# EasyEDA Pro project Hardware.epro, board PCB1
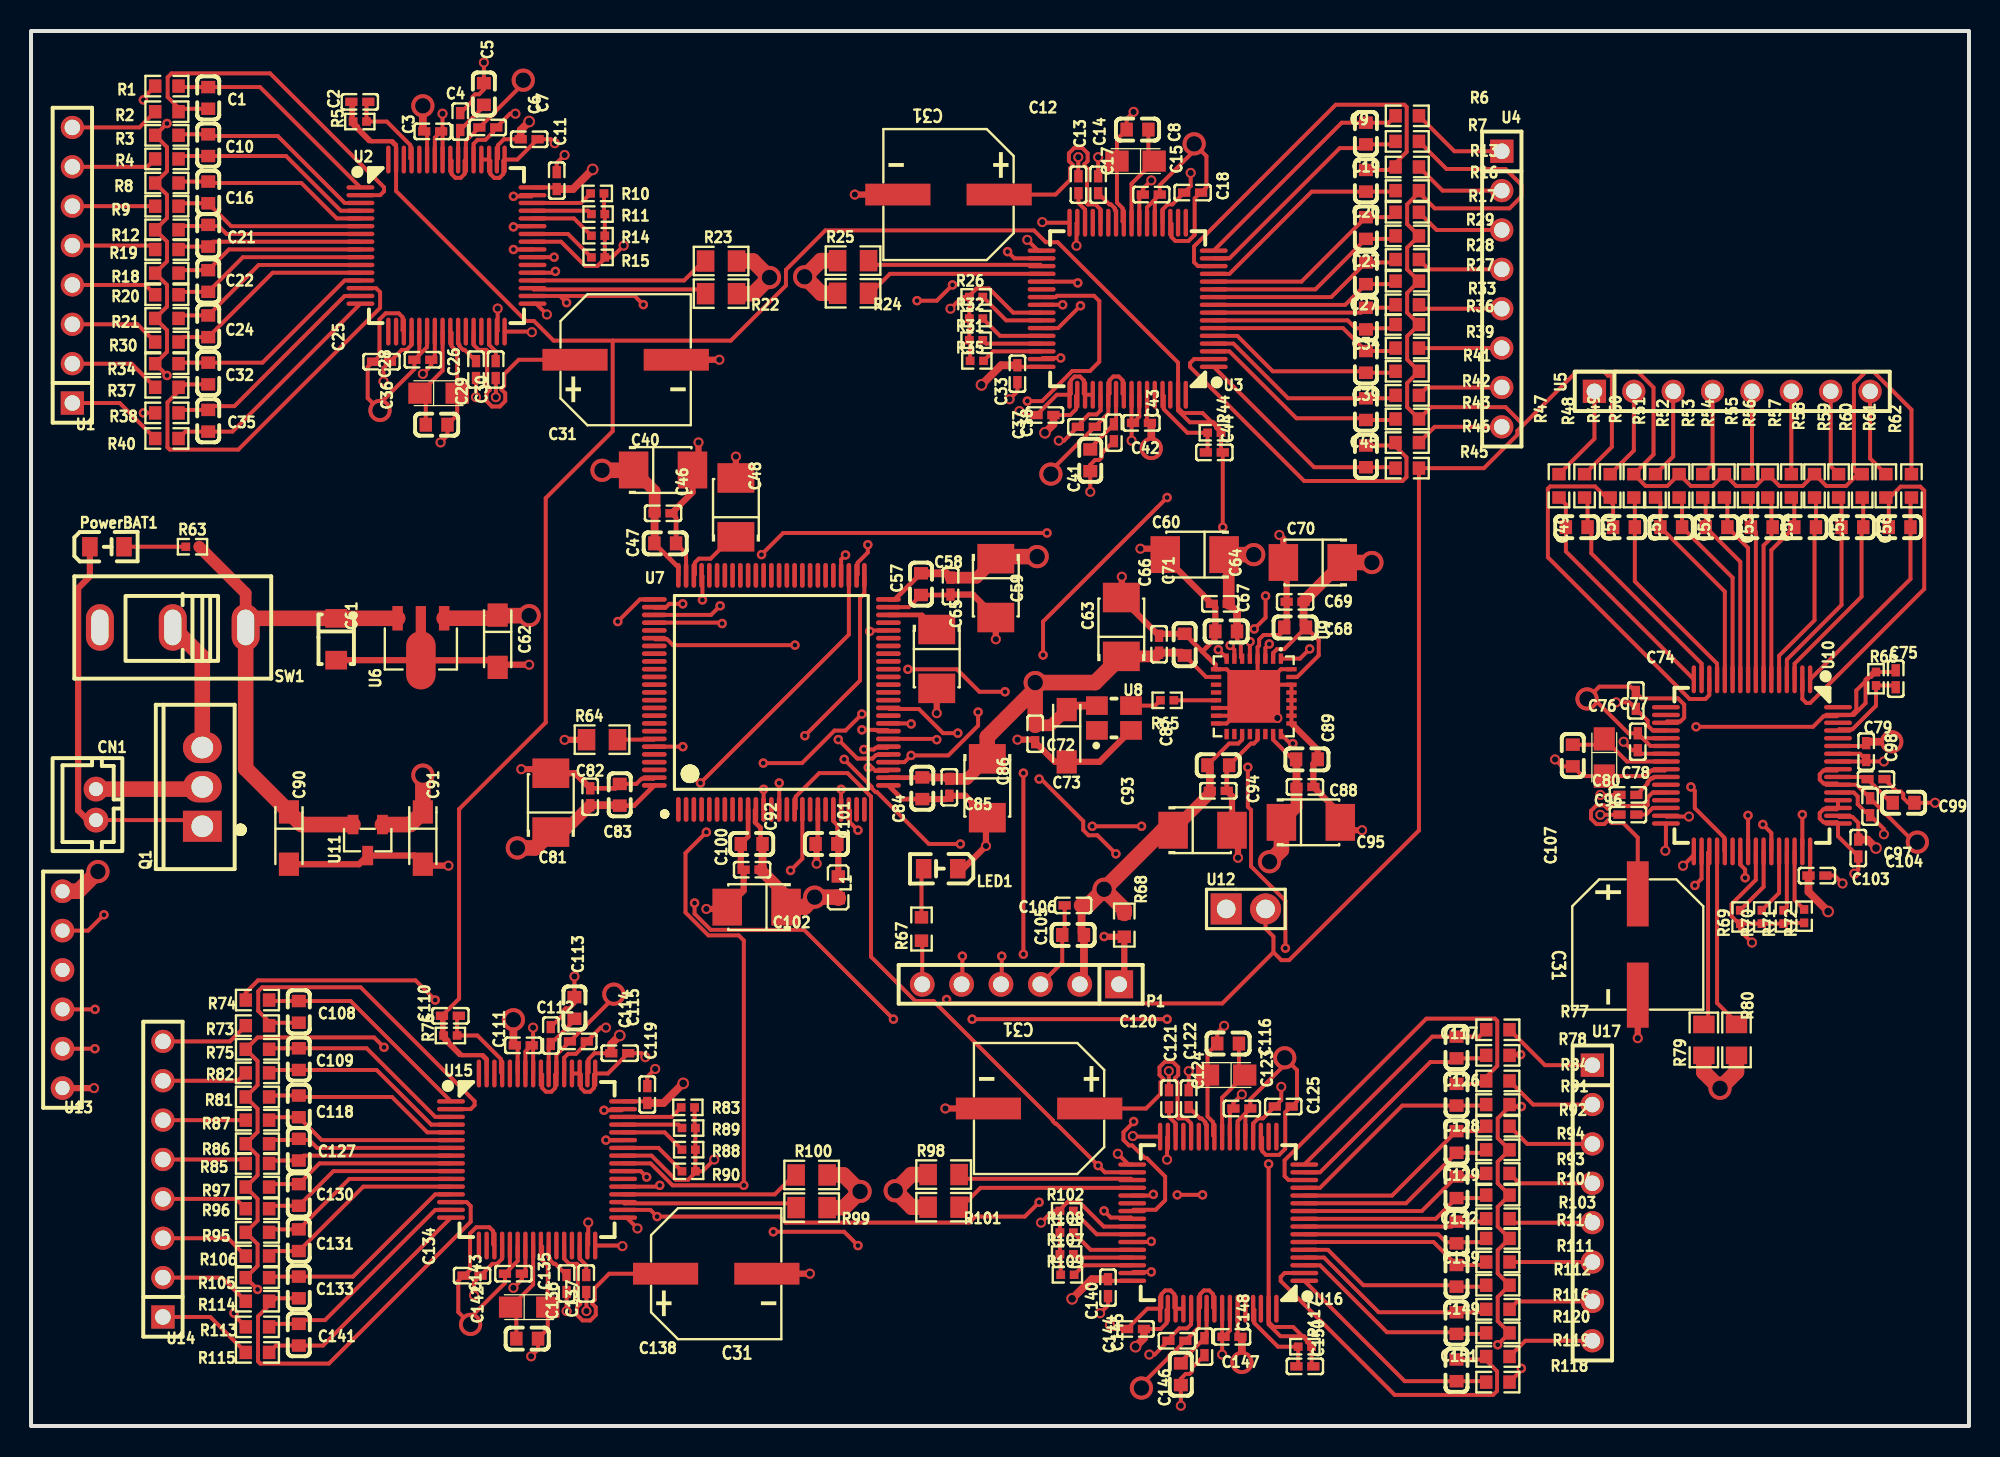
[diagram p1: board, top side]
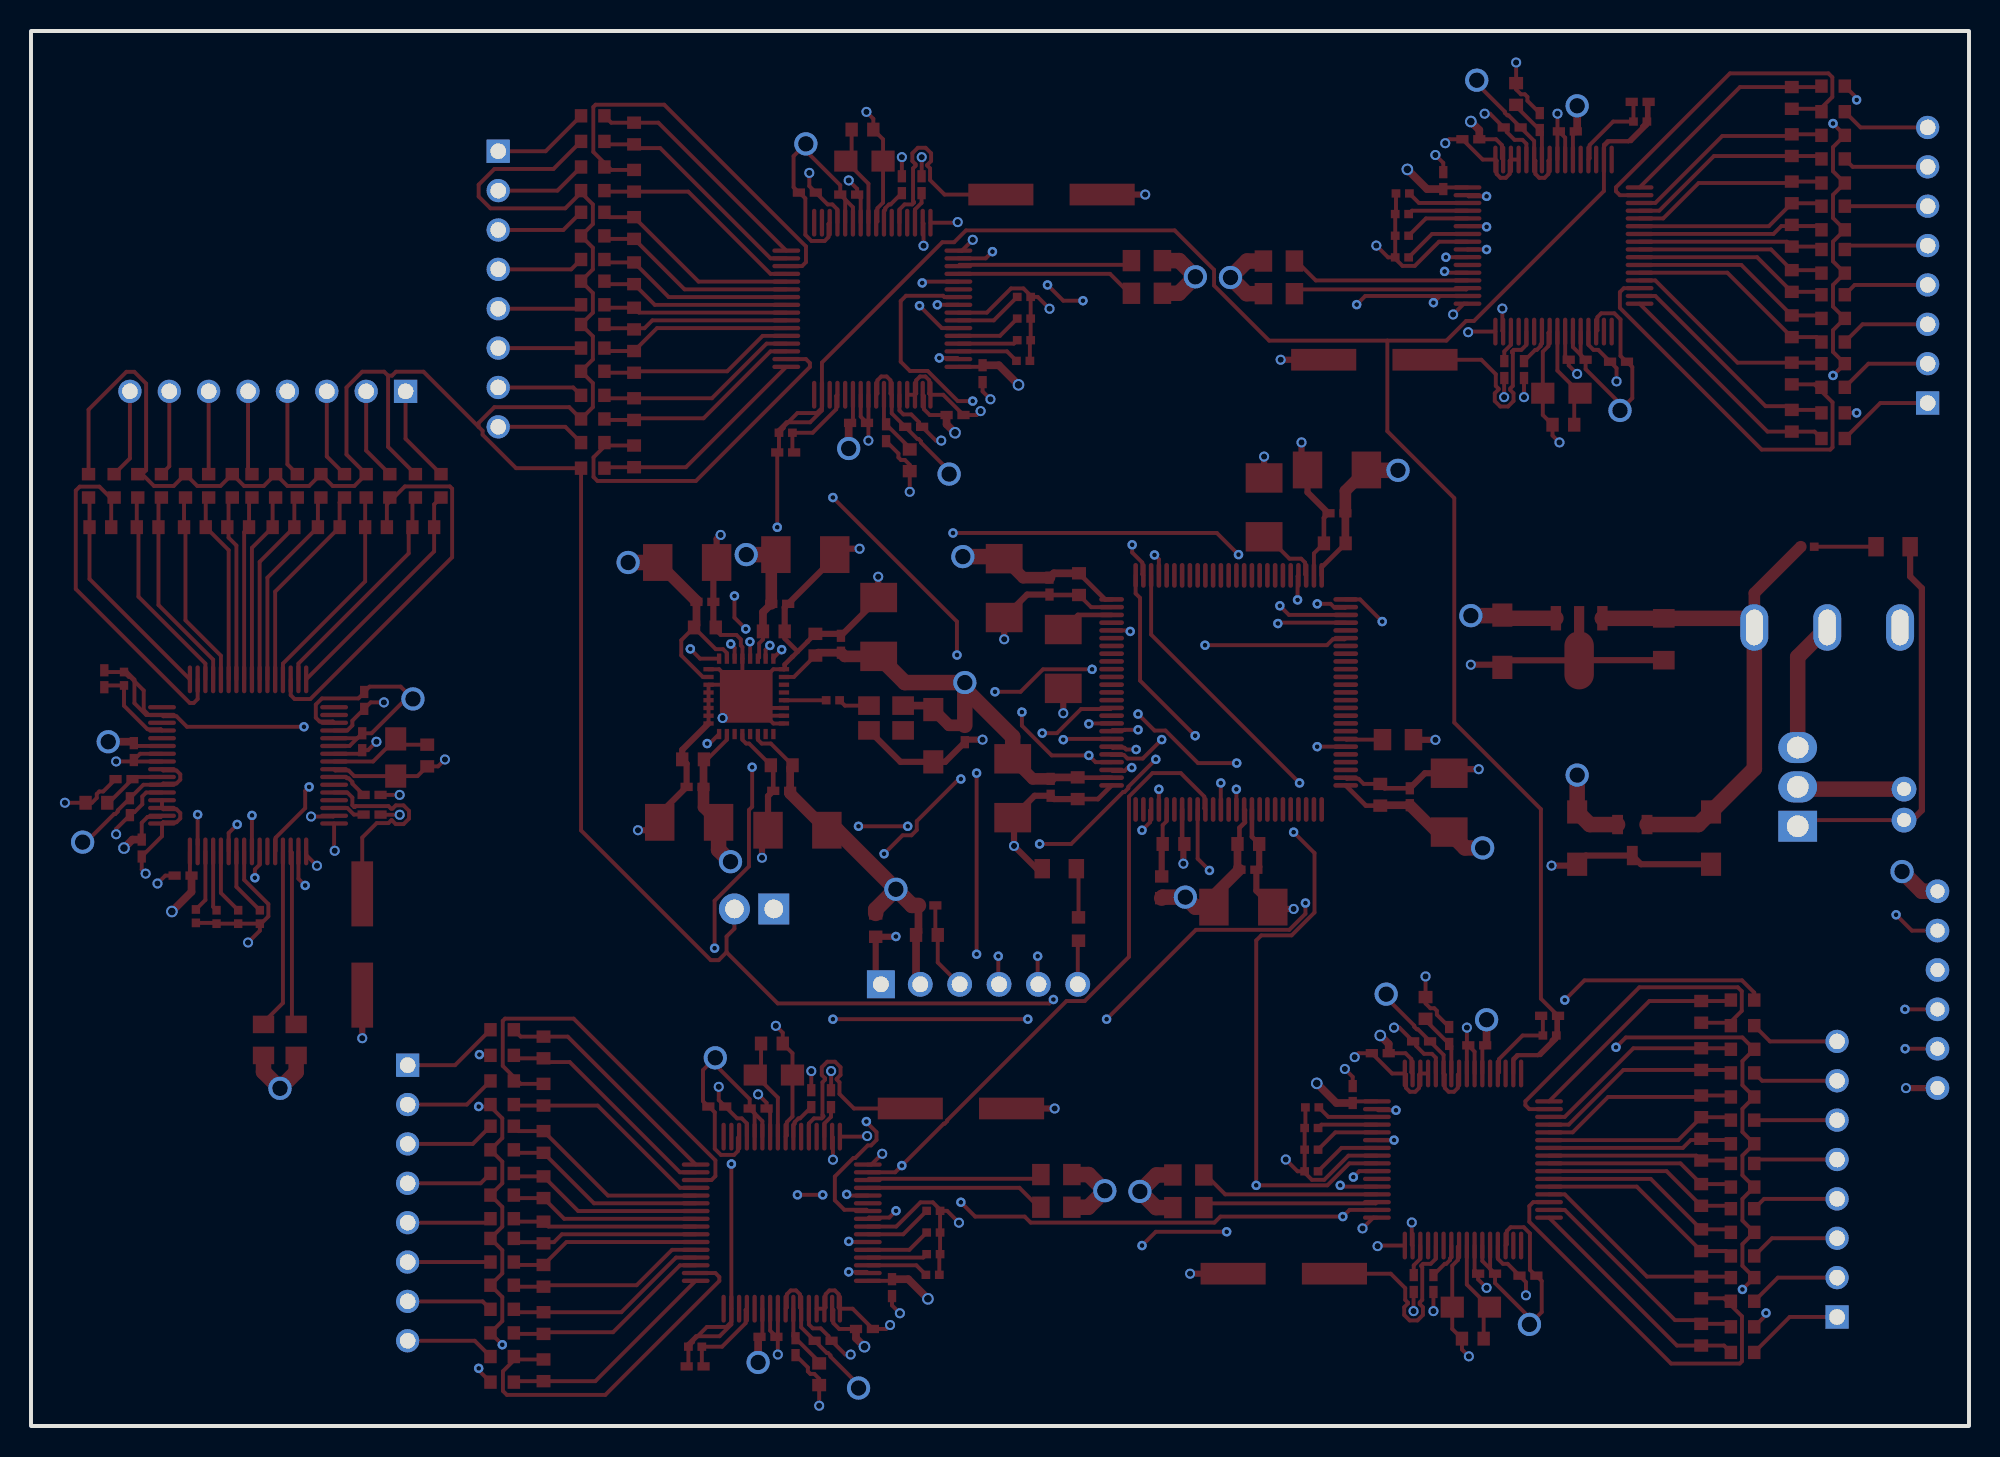
[diagram p2: board, bottom side, seen from below]

Outline 125 x 90 mm; copper layers: Top Layer, DGND, 3.3V, High-Speed Digital Signals, AGND, 5V, Shielding, Analog Signals, Low-Speed Digital Signals, Bottom Layer. Coordinates in mm from the lower left corner of the outline.
Outline path: rectangle 0,90 125,0
Stack: Top Layer 0.035mm / Dielectric1 0.1367mm PP er 4.5 / DGND 0.035mm / Dielectric2 0.1367mm PP er 4.5 / 3.3V 0.035mm / Dielectric3 0.1367mm PP er 4.5 / High-Speed Digital Signals 0.035mm / Dielectric4 0.1367mm PP er 4.5 / AGND 0.035mm / Dielectric5 0.1367mm FR4 er 4.5 / 5V 0.035mm / Dielectric6 0.1367mm PP er 4.5 / Shielding 0.035mm / Dielectric7 0.1367mm PP er 4.5 / Analog Signals 0.035mm / Dielectric8 0.1367mm PP er 4.5 / Low-Speed Digital Signals 0.035mm / Dielectric9 0.1367mm PP er 4.5 / Bottom Layer 0.035mm

## Design rules (mm)
template: Custom Config
spacing copperThickness1oz (default): track to track 0.102, other pairs 0.152 to 0.3
spacing copperThickness2oz: track to track 0.203, other pairs 0.152 to 0.3
spacing copperThicknessInner0.5oz: track to track 0.089, other pairs 0.152 to 0.3
track width copperThickness1oz (default): min 0.102, default 0.254, max 2.54
track width copperThickness2oz: min 0.203, default 0.254, max 2.54
track width copperThickness0.5oz: min 0.089, default 0.254, max 2.54
differential pair differentialPair (default): width min 0.127, default 0.254, max 2.54; gap min 0.152, default 0.152
via viaSize (default): diameter min 0.3, default 0.61, max 10; hole min 0.2, default 0.305, max 6.3

## Placement (name value [footprint] x y rotation side)
C1  1uF  [C0603]  11.43 85.68 90 top
C2  1uF  [C0402]  21.21 85.43 0 top
C3  330nF  [C0402]  25.91 83.52 180 top
C4  100nF  [C0402]  27.69 84.16 90 top
C5  1uF  [C0603]  29.21 85.94 90 top
C6  100nF  [C0402]  29.46 83.78 180 top
C7  1uF  [C0402]  32.13 83.02 180 top
C8  1uF  [C0603]  71.37 83.64 180 top
C9  100nF  [C0603]  86.1 83.39 270 top
C10  1uF  [C0603]  11.43 82.63 90 top
C11  47uF  [C0402]  33.91 80.35 270 top
C12  100nF  [CAP-SMD_BD8.0-L8.3-W8.3-FD]  59.18 79.45 180 top
C13  100nF  [C0402]  67.56 80.08 90 top
C14  1uF  [C0402]  68.83 80.08 90 top
C15  1uF  [CASE-A_3216]  71.24 81.61 180 top
C16  1uF  [C0603]  11.43 79.59 90 top
C17  10uF  [C0402]  72.26 79.45 180 top
C18  100nF  [C0402]  74.93 79.58 180 top
C19  47uF  [C0603]  86.1 80.34 270 top
C20  1uF  [C0603]  86.1 77.29 270 top
C21  100nF  [C0603]  11.43 76.79 90 top
C22  1uF  [C0603]  11.43 73.87 90 top
C23  100uF  [C0603]  86.1 74.37 270 top
C24  1uF  [C0603]  11.43 70.95 90 top
C25  100nF  [C0402]  22.61 68.66 0 top
C26  47uF  [C0402]  25.27 68.79 0 top
C27  1uF  [C0603]  86.1 71.45 270 top
C28  100nF  [CASE-A_3216]  26.29 66.63 0 top
C29  100nF  [C0402]  28.7 68.16 270 top
C30  1uF  [C0402]  29.97 68.16 270 top
C31  47uF  [CAP-SMD_BD8.0-L8.3-W8.3-FD]  38.35 68.79 0 top
C32  100nF  [C0603]  11.43 67.9 90 top
C33  1uF  [C0402]  63.62 67.89 90 top
C34  1uF  [C0603]  86.1 68.65 270 top
C35  100nF  [C0603]  11.43 64.85 90 top
C36  47uF  [C0603]  26.16 64.6 0 top
C37  2.2nF  [C0402]  65.4 65.22 0 top
C38  2.2nF  [C0402]  68.07 64.46 0 top
C39  47uF  [C0603]  86.1 65.61 270 top
C40  1uF  [CAP-SMD_L3.5-W2.8-R-RD]  40.77 61.68 180 top
C41  100nF  [C0603]  68.32 62.3 270 top
C42  2.2nF  [C0402]  69.85 64.08 270 top
C43  2.2nF  [C0402]  71.62 64.72 0 top
C44  100nF  [C0402]  76.32 62.81 180 top
C45  1uF  [C0603]  86.1 62.56 270 top
C46  47uF  [C0402]  40.77 58.89 180 top
C47  47uF  [C0603]  40.91 56.94 0 top
C48  47uF  [CAP-SMD_L3.5-W2.8-R-RD]  45.47 59.27 270 top
C49  1uF  [C0603]  99.7 57.99 0 top
C50  100nF  [C0603]  102.75 57.99 0 top
C51  2.2nF  [C0603]  105.79 57.99 0 top
C52  2.2nF  [C0603]  108.72 57.99 0 top
C53  47uF  [C0603]  111.64 57.99 0 top
C54  1uF  [C0603]  114.43 57.99 0 top
C55  100nF  [C0603]  117.48 57.99 0 top
C56  100nF  [C0603]  120.53 57.99 0 top
C57  1uF  [C0603]  57.4 54.31 270 top
C58  47uF  [C0402]  59.31 54.19 90 top
C59  2.2nF  [CAP-SMD_L3.5-W2.8-R-RD]  62.23 54.06 90 top
C60  2.2nF  [CAP-SMD_L3.5-W2.8-R-RD]  75.06 56.22 0 top
C61  47uF  [CAP-SMD_L3.2-W1.6]  19.69 50.76 270 top
C62  1uF  [CAP-SMD_L3.2-W1.6-RD]  30.1 50.63 270 top
C63  100nF  [CAP-SMD_L3.5-W2.8-R-RD]  70.33 51.55 270 top
C64  1uF  [C0402]  76.71 53.04 0 top
C65  47uF  [CAP-SMD_L3.5-W2.8-R-RD]  58.42 49.49 90 top
C66  1uF  [C0402]  72.76 50.44 90 top
C67  100nF  [C0603]  77.09 51.27 180 top
C68  100nF  [C0603]  81.53 51.52 0 top
C69  1uF  [C0402]  81.53 53.17 180 top
C70  47uF  [CAP-SMD_L3.5-W2.8-R-RD]  82.68 55.71 0 top
C71  100nF  [C0603]  74.41 50.41 270 top
C72  1uF  [C0402]  64.77 44.66 270 top
C73  100nF  [CAP-SMD_L3.2-W1.6-RD]  66.8 44.53 270 top
C74  1uF  [C0402]  103.51 46.81 270 top
C75  1uF  [C0402]  120.27 48.21 270 top
C76  100nF  [C0603]  99.44 43.26 270 top
C77  10uF  [CASE-A_3216]  101.48 43.13 270 top
C78  1uF  [C0402]  103.64 44.15 270 top
C79  1uF  [C0402]  118.37 43.51 90 top
C80  1uF  [C0402]  103 40.72 180 top
C81  47uF  [CAP-SMD_L3.5-W2.8-R-RD]  33.53 40.22 270 top
C82  1uF  [C0402]  36.07 40.6 270 top
C83  100nF  [C0603]  37.97 40.72 90 top
C84  100nF  [C0603]  57.49 41.15 270 top
C85  1uF  [C0402]  59.23 41.21 90 top
C86  47uF  [CAP-SMD_L3.5-W2.8-R-RD]  61.68 41.15 90 top
C87  100nF  [C0603]  76.58 42.63 180 top
C88  1uF  [C0402]  82.17 41.23 180 top
C89  100nF  [C0603]  82.3 43.01 0 top
C90  100nF  [CAP-SMD_L3.2-W1.6-RD]  16.64 37.93 270 top
C91  100nF  [CAP-SMD_L3.2-W1.6-RD]  25.27 37.93 270 top
C92  100nF  [C0603]  46.48 37.55 180 top
C93  47uF  [CAP-SMD_L3.5-W2.8-R-RD]  75.56 38.44 180 top
C94  1uF  [C0402]  76.58 40.98 0 top
C95  47uF  [CAP-SMD_L3.5-W2.8-R-RD]  82.55 38.95 180 top
C96  1uF  [C0402]  103 39.45 180 top
C97  1uF  [C0402]  118.62 39.95 90 top
C98  1uF  [C0402]  119 41.73 0 top
C99  100nF  [C0603]  120.78 40.21 0 top
C100  1uF  [C0402]  46.51 35.89 0 top
C101  100nF  [C0603]  51.31 37.55 0 top
C102  47uF  [CAP-SMD_L3.5-W2.8-R-RD]  46.8 33.48 0 top
C103  1uF  [C0402]  115.19 35.51 180 top
C104  1uF  [C0402]  117.86 37.29 90 top
C105  100nF  [C0603]  67.22 31.68 0 top
C106  1uF  [C0402]  67.22 33.59 180 top
C107  100uF  [CAP-SMD_BD8.0-L8.3-W8.3-FD]  103.64 31.06 270 top
C108  2.2nF  [C0603]  17.27 26.72 90 top
C109  2.2nF  [C0603]  17.27 23.67 90 top
C110  1uF  [C0402]  27.05 26.46 0 top
C111  1uF  [C0402]  31.75 24.56 180 top
C112  1uF  [C0402]  33.53 25.19 90 top
C113  100nF  [C0603]  35.05 26.97 90 top
C114  1uF  [C0402]  35.31 24.81 180 top
C115  1uF  [C0402]  37.97 24.05 180 top
C116  100nF  [C0603]  77.21 24.67 180 top
C117  2.2nF  [C0603]  91.94 24.42 270 top
C118  2.2nF  [C0603]  17.27 20.62 90 top
C119  1uF  [C0402]  39.75 21.38 270 top
C120  100uF  [CAP-SMD_BD8.0-L8.3-W8.3-FD]  65.02 20.48 180 top
C121  1uF  [C0402]  73.4 21.12 90 top
C122  1uF  [C0402]  74.67 21.12 90 top
C123  10uF  [CASE-A_3216]  77.09 22.64 180 top
C124  1uF  [C0402]  78.1 20.48 180 top
C125  1uF  [C0402]  80.77 20.61 180 top
C126  2.2nF  [C0603]  91.94 21.37 270 top
C127  2.2nF  [C0603]  17.27 17.83 90 top
C128  2.2nF  [C0603]  91.94 18.32 270 top
C129  2.2nF  [C0603]  91.94 15.4 270 top
C130  2.2nF  [C0603]  17.27 14.91 90 top
C131  2.2nF  [C0603]  17.27 11.99 90 top
C132  2.2nF  [C0603]  91.94 12.48 270 top
C133  2.2nF  [C0603]  17.27 8.94 90 top
C134  1uF  [C0402]  28.45 9.7 0 top
C135  1uF  [C0402]  31.11 9.83 0 top
C136  1uF  [C0402]  34.54 9.19 270 top
C137  1uF  [C0402]  35.81 9.19 270 top
C138  100uF  [CAP-SMD_BD8.0-L8.3-W8.3-FD]  44.2 9.83 0 top
C139  2.2nF  [C0603]  91.94 9.69 270 top
C140  1uF  [C0402]  69.47 8.93 90 top
C141  2.2nF  [C0603]  17.27 5.89 90 top
C142  100nF  [C0603]  32 5.64 0 top
C143  10uF  [CASE-A_3216]  32.13 7.67 0 top
C144  1uF  [C0402]  71.24 6.26 0 top
C145  1uF  [C0402]  73.91 5.5 0 top
C146  100nF  [C0603]  74.16 3.34 270 top
C147  1uF  [C0402]  75.69 5.12 270 top
C148  1uF  [C0402]  77.47 5.75 0 top
C149  2.2nF  [C0603]  91.94 6.64 270 top
C150  1uF  [C0402]  82.16 3.85 180 top
C151  2.2nF  [C0603]  91.94 3.59 270 top
CN1  B2B-PH-K-S(LF)(SN)  [CONN-TH_B2B-PH-K-S]  4.19 40.09 90 top
L1  BLM18KG601SN1D  [L0603]  52.07 34.75 90 top
LED1  GREEN  [LED0805-RD_GREEN]  58.68 35.95 180 top
P1  HC-05 Input  [HDR-TH_6P-P2.54-V-F]  63.83 28.5 180 top
PowerBAT1  LTST-C170GKT  [LED0805-RD_GREEN]  4.9 56.73 0 top
Q1  FQP47P06  [TO-220F-3_L10.2-W4.9-P2.54-L]  11.05 41.23 90 top
R1  1MΩ  [R0603]  8.76 86.44 0 top
R2  10kΩ  [R0603]  8.76 84.79 0 top
R3  10kΩ  [R0603]  8.76 83.27 0 top
R4  10kΩ  [R0603]  8.76 81.75 0 top
R5  10kΩ  [R0402]  21.21 84.16 180 top
R6  10kΩ  [R0603]  88.77 84.53 180 top
R7  150Ω  [R0603]  88.77 82.88 180 top
R8  10kΩ  [R0603]  8.76 80.19 0 top
R9  10kΩ  [R0603]  8.76 78.7 0 top
R10  10kΩ  [R0402]  36.53 79.52 0 top
R11  33Ω  [R0402]  36.58 78.19 0 top
R12  68Ω  [R0603]  8.76 77.17 0 top
R13  499kΩ  [R0603]  88.77 81.23 180 top
R14  499kΩ  [R0402]  36.58 76.79 0 top
R15  499kΩ  [R0402]  36.58 75.39 0 top
R16  499kΩ  [R0603]  88.77 79.7 180 top
R17  499kΩ  [R0603]  88.77 78.31 180 top
R18  499kΩ  [R0603]  8.76 74.38 0 top
R19  499kΩ  [R0603]  8.76 75.9 0 top
R20  499kΩ  [R0603]  8.76 72.98 0 top
R21  499kΩ  [R0603]  8.76 71.46 0 top
R22  499kΩ  [R0805]  44.51 73.05 180 top
R23  499kΩ  [R0805]  44.51 75.16 180 top
R24  499kΩ  [R0805]  53.02 73.08 0 top
R25  499kΩ  [R0805]  53.02 75.19 0 top
R26  499kΩ  [R0402]  60.96 72.84 180 top
R27  499kΩ  [R0603]  88.77 73.86 180 top
R28  499kΩ  [R0603]  88.77 75.26 180 top
R29  499kΩ  [R0603]  88.77 76.78 180 top
R30  499kΩ  [R0603]  8.76 69.93 0 top
R31  10kΩ  [R0402]  60.96 70.05 180 top
R32  10kΩ  [R0402]  60.96 71.45 180 top
R33  499kΩ  [R0603]  88.77 72.34 180 top
R34  499kΩ  [R0603]  8.76 68.54 0 top
R35  10kΩ  [R0402]  61.01 68.72 180 top
R36  499kΩ  [R0603]  88.77 71.07 180 top
R37  499kΩ  [R0603]  8.76 67.01 0 top
R38  499kΩ  [R0603]  8.76 65.36 0 top
R39  499kΩ  [R0603]  88.77 69.54 180 top
R40  499kΩ  [R0603]  8.76 63.71 0 top
R41  499kΩ  [R0603]  88.77 68.05 180 top
R42  499kΩ  [R0603]  88.77 66.49 180 top
R43  499kΩ  [R0603]  88.77 64.97 180 top
R44  1MΩ  [R0402]  76.32 64.08 0 top
R45  499kΩ  [R0603]  88.77 61.8 180 top
R46  499kΩ  [R0603]  88.77 63.45 180 top
R47  499kΩ  [R0603]  98.56 60.66 270 top
R48  499kΩ  [R0603]  100.21 60.66 270 top
R49  499kΩ  [R0603]  101.86 60.66 270 top
R50  499kΩ  [R0603]  103.38 60.66 270 top
R51  499kΩ  [R0603]  104.78 60.66 270 top
R52  499kΩ  [R0603]  106.3 60.66 270 top
R53  499kΩ  [R0603]  107.83 60.66 270 top
R54  499kΩ  [R0603]  109.22 60.66 270 top
R55  499kΩ  [R0603]  110.75 60.66 270 top
R56  499kΩ  [R0603]  112.02 60.66 270 top
R57  499kΩ  [R0603]  113.54 60.66 270 top
R58  499kΩ  [R0603]  115.04 60.66 270 top
R59  499kΩ  [R0603]  116.59 60.66 270 top
R60  499kΩ  [R0603]  118.11 60.66 270 top
R61  499kΩ  [R0603]  119.64 60.66 270 top
R62  499kΩ  [R0603]  121.29 60.66 270 top
R63  150Ω  [R0402]  10.42 56.73 0 top
R64  10kΩ  [R0805]  36.83 44.28 0 top
R65  33Ω  [R0402]  73.28 46.82 0 top
R66  1MΩ  [R0402]  119 48.21 90 top
R67  68Ω  [R0603]  57.44 32.06 90 top
R68  10kΩ  [R0603]  70.52 32.32 90 top
R69  10kΩ  [R0402]  110.24 32.84 270 top
R70  10kΩ  [R0402]  111.64 32.84 270 top
R71  10kΩ  [R0402]  113.03 32.84 270 top
R72  10kΩ  [R0402]  114.37 32.89 270 top
R73  499kΩ  [R0603]  14.61 25.83 0 top
R74  499kΩ  [R0603]  14.61 27.48 0 top
R75  499kΩ  [R0603]  14.61 24.31 0 top
R76  1MΩ  [R0402]  27.05 25.19 180 top
R77  499kΩ  [R0603]  94.61 25.56 180 top
R78  499kΩ  [R0603]  94.61 23.91 180 top
R79  10kΩ  [R0805]  107.9 24.91 90 top
R80  10kΩ  [R0805]  110 24.91 90 top
R81  499kΩ  [R0603]  14.61 21.23 0 top
R82  499kΩ  [R0603]  14.61 22.78 0 top
R83  10kΩ  [R0402]  42.37 20.56 0 top
R84  499kΩ  [R0603]  94.61 22.26 180 top
R85  499kΩ  [R0603]  14.61 16.94 0 top
R86  499kΩ  [R0603]  14.61 18.21 0 top
R87  499kΩ  [R0603]  14.61 19.73 0 top
R88  10kΩ  [R0402]  42.42 17.83 0 top
R89  10kΩ  [R0402]  42.42 19.22 0 top
R90  10kΩ  [R0402]  42.42 16.43 0 top
R91  499kΩ  [R0603]  94.61 20.74 180 top
R92  499kΩ  [R0603]  94.61 19.34 180 top
R93  499kΩ  [R0603]  94.61 16.29 180 top
R94  499kΩ  [R0603]  94.61 17.82 180 top
R95  499kΩ  [R0603]  14.61 12.49 0 top
R96  499kΩ  [R0603]  14.61 14.02 0 top
R97  499kΩ  [R0603]  14.61 15.41 0 top
R98  10kΩ  [R0805]  58.86 16.22 0 top
R99  10kΩ  [R0805]  50.35 14.09 180 top
R100  10kΩ  [R0805]  50.35 16.2 180 top
R101  10kΩ  [R0805]  58.86 14.12 0 top
R102  10kΩ  [R0402]  66.8 13.88 180 top
R103  499kΩ  [R0603]  94.61 13.37 180 top
R104  499kΩ  [R0603]  94.61 14.9 180 top
R105  499kΩ  [R0603]  14.61 9.57 0 top
R106  499kΩ  [R0603]  14.61 10.97 0 top
R107  10kΩ  [R0402]  66.8 11.09 180 top
R108  10kΩ  [R0402]  66.8 12.48 180 top
R109  10kΩ  [R0402]  66.85 9.75 180 top
R110  499kΩ  [R0603]  94.61 12.1 180 top
R111  499kΩ  [R0603]  94.61 10.58 180 top
R112  499kΩ  [R0603]  94.61 9.08 180 top
R113  499kΩ  [R0603]  14.61 6.4 0 top
R114  499kΩ  [R0603]  14.61 8.05 0 top
R115  499kΩ  [R0603]  14.61 4.75 0 top
R116  499kΩ  [R0603]  94.61 7.53 180 top
R117  1MΩ  [R0402]  82.16 5.12 0 top
R118  499kΩ  [R0603]  94.61 2.83 180 top
R119  499kΩ  [R0603]  94.61 4.48 180 top
R120  499kΩ  [R0603]  94.61 6.01 180 top
SW1  SS-12D10-G050  [SW-TH_SS-12D10-G050]  9.14 51.52 180 top
U1  ADS1299IPAGR  [HDR-TH_8P-P2.54-V-M]  2.67 74.89 90 top
U2  DS1021-1x6SF11-B  [TQFP-64_L10.0-W10.0-P0.50-LS12.0-TL]  26.8 76.16 0 top
U3  MC78L05ACHT1G  [TQFP-64_L10.0-W10.0-P0.50-LS12.0-TL]  70.74 72.08 180 top
U4  HB-PH3-25418PB2GOP  [HDR-TH_8P-P2.54-V-M]  94.87 73.35 270 top
U5  LM3480IM3X-3.3  [HDR-TH_8P-P2.54-V-M]  109.73 66.75 0 top
U6  STM32H750VBT6  [SOT-89-3_L4.5-W2.5-P1.50-LS4.2-BR]  25.15 50.76 90 top
U7  DS1021-1x2SF11-B  [LQFP-100_L14.0-W14.0-P0.50-LS16.0-BL]  47.75 47.33 0 top
U8  2.048MHz  [OSC-SMD_4P-L3.2-W2.5-BL-1]  69.85 45.68 0 top
U9  CDCLVC1310RHBR  [QFN-32_L5.0-W5.0-P0.50-TL-EP3.4]  78.87 47.07 270 top
U10  ADS1299IPAGR  [TQFP-64_L10.0-W10.0-P0.50-LS12.0-TL]  111 42.62 270 top
U11  LM3480IM3X-3.3  [SOT-23-3_L2.9-W1.3-P1.90-LS2.4-BR]  21.72 37.8 90 top
U12  DS1021-1x2SF11-B  [HDR-TH_2P-P2.54-V-M]  78.36 33.36 0 top
U13  DS1021-1x6SF11-B  [CONN-TH_DS1021-1X6SF11-B]  2.03 28.15 270 top
U14  HB-PH3-25418PB2GOP  [HDR-TH_8P-P2.54-V-M]  8.51 15.92 90 top
U15  ADS1299IPAGR  [TQFP-64_L10.0-W10.0-P0.50-LS12.0-TL]  32.64 17.19 0 top
U16  ADS1299IPAGR  [TQFP-64_L10.0-W10.0-P0.50-LS12.0-TL]  76.58 13.12 180 top
U17  HB-PH3-25418PB2GOP  [HDR-TH_8P-P2.54-V-M]  100.71 14.39 270 top

## Footprints (pads in the part's own frame, mm; a bottom-side part is the same pattern mirrored in y, then rotated)
C0402
  rect 0.79x0.54 smd: 1(-0.545,0) 2(0.545,0)
C0603
  rect 0.8x0.9 smd: 1(-0.7,0) 2(0.7,0)
CAP-SMD_BD8.0-L8.3-W8.3-FD
  rect 4.2x1.4 smd: 1(-3.267,0) 2(3.267,0)
CAP-SMD_L3.2-W1.6
  rect 1.2x1.4 smd: 1(-1.35,0) 2(1.35,0)
CAP-SMD_L3.2-W1.6-RD
  rect 1.5x1.296 smd: 1(-1.687,0) 2(1.687,0)
CAP-SMD_L3.5-W2.8-R-RD
  rect 1.9x2.376 smd: 1(1.899,0) 2(-1.899,0)
CASE-A_3216
  rect 1.5x1.359 smd: 1(-1.2,0) 2(1.2,0)
CONN-TH_B2B-PH-K-S
  round 1.6 hole 0.9: 1(1,0) 2(-1,0)
CONN-TH_DS1021-1X6SF11-B
  round 1.524 hole 0.914: 1(-6.35,0) 2(-3.81,0) 3(-1.27,0) 4(1.27,0) 5(3.81,0) 6(6.35,0)
HDR-TH_2P-P2.54-V-M
  rect 2x2 hole 1.2: 1(-1.27,0)
  round 2 hole 1.2: 2(1.27,0)
HDR-TH_6P-P2.54-V-F
  rect 1.8x1.8 hole 1.02: 1(-6.35,0)
  round 1.6 hole 1.02: 2(-3.81,0) 3(-1.27,0) 4(1.27,0) 5(3.81,0) 6(6.35,0)
HDR-TH_8P-P2.54-V-M
  rect 1.5x1.5 hole 1: 1(-8.89,0)
  round 1.5 hole 1: 2(-6.35,0) 3(-3.81,0) 4(-1.27,0) 5(1.27,0) 6(3.81,0) 7(6.35,0) 8(8.89,0)
L0603
  rect 0.8x0.864 smd: 1(-0.7,0) 2(0.7,0)
LED0805-RD_GREEN
  rect 1x1.25 smd: 1(-1.1,0) 2(1.1,0)
LQFP-100_L14.0-W14.0-P0.50-LS16.0-BL
  oval 0.3x1.6 smd: 1(-6,-7.55) 2(-5.5,-7.55) 3(-5,-7.55) 4(-4.5,-7.55) 5(-4,-7.55) 6(-3.5,-7.55) 7(-3,-7.55) 8(-2.5,-7.55) 9(-2,-7.55) 10(-1.5,-7.55) 11(-1,-7.55) 12(-0.5,-7.55) 13(0,-7.55) 14(0.5,-7.55) 15(1,-7.55) 16(1.5,-7.55) 17(2,-7.55) 18(2.5,-7.55) 19(3,-7.55) 20(3.5,-7.55) 21(4,-7.55) 22(4.5,-7.55) 23(5,-7.55) 24(5.5,-7.55) 25(6,-7.55) 51(6,7.55) 52(5.5,7.55) 53(5,7.55) 54(4.5,7.55) 55(4,7.55) 56(3.5,7.55) 57(3,7.55) 58(2.5,7.55) 59(2,7.55) 60(1.5,7.55) 61(1,7.55) 62(0.5,7.55) 63(0,7.55) 64(-0.5,7.55) 65(-1,7.55) 66(-1.5,7.55) 67(-2,7.55) 68(-2.5,7.55) 69(-3,7.55) 70(-3.5,7.55) 71(-4,7.55) 72(-4.5,7.55) 73(-5,7.55) 74(-5.5,7.55) 75(-6,7.55)
  oval 1.6x0.3 smd: 26(7.55,-6) 27(7.55,-5.5) 28(7.55,-5) 29(7.55,-4.5) 30(7.55,-4) 31(7.55,-3.5) 32(7.55,-3) 33(7.55,-2.5) 34(7.55,-2) 35(7.55,-1.5) 36(7.55,-1) 37(7.55,-0.5) 38(7.55,0) 39(7.55,0.5) 40(7.55,1) 41(7.55,1.5) 42(7.55,2) 43(7.55,2.5) 44(7.55,3) 45(7.55,3.5) 46(7.55,4) 47(7.55,4.5) 48(7.55,5) 49(7.55,5.5) 50(7.55,6) 76(-7.55,6) 77(-7.55,5.5) 78(-7.55,5) 79(-7.55,4.5) 80(-7.55,4) 81(-7.55,3.5) 82(-7.55,3) 83(-7.55,2.5) 84(-7.55,2) 85(-7.55,1.5) 86(-7.55,1) 87(-7.55,0.5) 88(-7.55,0) 89(-7.55,-0.5) 90(-7.55,-1) 91(-7.55,-1.5) 92(-7.55,-2) 93(-7.55,-2.5) 94(-7.55,-3) 95(-7.55,-3.5) 96(-7.55,-4) 97(-7.55,-4.5) 98(-7.55,-5) 99(-7.55,-5.5) 100(-7.55,-6)
OSC-SMD_4P-L3.2-W2.5-BL-1
  rect 1.4x1.2 smd: 1(-1.1,-0.8) 2(1.1,-0.8) 3(1.1,0.8) 4(-1.1,0.8)
QFN-32_L5.0-W5.0-P0.50-TL-EP3.4
  rect 0.665x0.28 smd: 1(-2.433,1.75) 2(-2.433,1.25) 3(-2.433,0.75) 4(-2.433,0.25) 5(-2.433,-0.25) 6(-2.433,-0.75) 7(-2.433,-1.25) 8(-2.433,-1.75) 17(2.433,-1.75) 18(2.433,-1.25) 19(2.433,-0.75) 20(2.433,-0.25) 21(2.433,0.25) 22(2.433,0.75) 23(2.433,1.25) 24(2.433,1.75)
  rect 0.28x0.665 smd: 9(-1.75,-2.433) 10(-1.25,-2.433) 11(-0.75,-2.433) 12(-0.25,-2.433) 13(0.25,-2.433) 14(0.75,-2.433) 15(1.25,-2.433) 16(1.75,-2.433) 25(1.75,2.433) 26(1.25,2.433) 27(0.75,2.433) 28(0.25,2.433) 29(-0.25,2.433) 30(-0.75,2.433) 31(-1.25,2.433) 32(-1.75,2.433)
  rect 3.4x3.4 smd: 33(0,0)
R0402
  rect 0.566x0.54 smd: 1(-0.433,0) 2(0.433,0)
R0603
  rect 0.806x0.864 smd: 1(-0.753,0) 2(0.753,0)
R0805
  rect 1.133x1.377 smd: 1(-1,0) 2(1,0)
SOT-23-3_L2.9-W1.3-P1.90-LS2.4-BR
  rect 1.25x0.7 smd: 1(1,-0.95) 2(1,0.95) 3(-1,0)
SOT-89-3_L4.5-W2.5-P1.50-LS4.2-BR
  rect 1.575x0.672 smd: 1(1.356,-1.5) 3(1.356,1.5)
  custom 5.377x1.9 smd: 2(-1.356,0)
SW-TH_SS-12D10-G050
  oval 1.8x3 hole 1.1x2.3: 1(-4.7,0) 2(0,0) 3(4.7,0)
TO-220F-3_L10.2-W4.9-P2.54-L
  rect 2x2.5 hole 1.4: 1(-2.54,0)
  oval 2x2.5 hole 1.4: 2(0,0) 3(2.54,0)
TQFP-64_L10.0-W10.0-P0.50-LS12.0-TL
  oval 1.8x0.28 smd: 1(-5.55,3.75) 2(-5.55,3.25) 3(-5.55,2.75) 4(-5.55,2.25) 5(-5.55,1.75) 6(-5.55,1.25) 7(-5.55,0.75) 8(-5.55,0.25) 9(-5.55,-0.25) 10(-5.55,-0.75) 11(-5.55,-1.25) 12(-5.55,-1.75) 13(-5.55,-2.25) 14(-5.55,-2.75) 15(-5.55,-3.25) 16(-5.55,-3.75) 33(5.55,-3.75) 34(5.55,-3.25) 35(5.55,-2.75) 36(5.55,-2.25) 37(5.55,-1.75) 38(5.55,-1.25) 39(5.55,-0.75) 40(5.55,-0.25) 41(5.55,0.25) 42(5.55,0.75) 43(5.55,1.25) 44(5.55,1.75) 45(5.55,2.25) 46(5.55,2.75) 47(5.55,3.25) 48(5.55,3.75)
  oval 0.28x1.8 smd: 17(-3.75,-5.55) 18(-3.25,-5.55) 19(-2.75,-5.55) 20(-2.25,-5.55) 21(-1.75,-5.55) 22(-1.25,-5.55) 23(-0.75,-5.55) 24(-0.25,-5.55) 25(0.25,-5.55) 26(0.75,-5.55) 27(1.25,-5.55) 28(1.75,-5.55) 29(2.25,-5.55) 30(2.75,-5.55) 31(3.25,-5.55) 32(3.75,-5.55) 49(3.75,5.55) 50(3.25,5.55) 51(2.75,5.55) 52(2.25,5.55) 53(1.75,5.55) 54(1.25,5.55) 55(0.75,5.55) 56(0.25,5.55) 57(-0.25,5.55) 58(-0.75,5.55) 59(-1.25,5.55) 60(-1.75,5.55) 61(-2.25,5.55) 62(-2.75,5.55) 63(-3.25,5.55) 64(-3.75,5.55)

## Nets
+3.3V: C7.2 C11.2 C33.2 C37.2 C40.1 C46.2 C47.1 C57.1 C58.2 C59.1 C60.1 C63.1 C64.2 C66.1 C67.1 C68.2 C69.1 C70.1 C71.2 C72.1 C73.1 C81.1 C82.2 C83.1 C84.1 C85.2 C86.1 C87.2 C88.2 C89.1 C91.1 C92.1 C93.1 C94.1 C95.1 C100.2 C102.1 C103.2 C104.2 C105.2 C106.1 C115.2 C119.2 C140.2 C144.2 L1.1 P1.2 R22.1 R23.1 R24.1 R25.1 R68.2 R79.1 R80.1 R98.1 R99.1 R100.1 R101.1 U2.48 U2.50 U3.48 U3.50 U7.11 U7.27 U7.50 U7.75 U7.100 U8.4 U9.2 U9.6 U9.10 U9.19 U9.23 U9.31 U10.48 U10.50 U11.1 U13.1 U15.48 U15.50 U16.48 U16.50
+5V: C3.2 C6.2 C17.1 C18.1 C25.1 C26.1 C38.2 C43.2 C62.1 C74.1 C78.1 C79.2 C97.2 C111.2 C114.2 C124.1 C125.1 C134.1 C135.1 C145.2 C148.2 U2.19 U2.21 U2.22 U2.54 U2.56 U2.59 U3.19 U3.21 U3.22 U3.54 U3.56 U3.59 U6.1 U10.19 U10.21 U10.22 U10.54 U10.56 U10.59 U15.19 U15.21 U15.22 U15.54 U15.56 U15.59 U16.19 U16.21 U16.22 U16.54 U16.56 U16.59
AGND: C3.1 C4.2 C5.2 C6.1 C8.2 C12.2 C13.2 C14.2 C15.2 C17.2 C18.2 C25.2 C26.2 C28.2 C29.2 C30.2 C31.2 C36.2 C38.1 C41.2 C42.2 C43.1 C61.2 C62.2 C74.2 C76.2 C77.2 C78.2 C79.1 C80.2 C96.2 C97.1 C98.2 C99.2 C107.2 C111.1 C112.2 C113.2 C114.1 C116.2 C120.2 C121.2 C122.2 C123.2 C124.2 C125.2 C134.2 C135.2 C136.2 C137.2 C138.2 C142.2 C143.2 C145.1 C146.2 C147.2 C148.1 U2.20 U2.23 U2.25 U2.32 U2.53 U2.57 U2.58 U3.20 U3.23 U3.25 U3.32 U3.53 U3.57 U3.58 U6.2 U10.20 U10.23 U10.25 U10.32 U10.53 U10.57 U10.58 U15.20 U15.23 U15.25 U15.32 U15.53 U15.57 U15.58 U16.20 U16.23 U16.25 U16.32 U16.53 U16.57 U16.58
DGND: C7.1 C11.1 C33.1 C37.1 C40.2 C46.1 C47.2 C48.2 C57.2 C58.1 C59.2 C60.2 C63.2 C64.1 C65.2 C66.2 C67.2 C68.1 C69.2 C70.2 C71.1 C72.2 C73.2 C81.2 C82.1 C83.2 C84.2 C85.1 C86.2 C87.1 C88.1 C89.2 C90.2 C91.2 C92.2 C93.2 C94.2 C95.2 C100.1 C101.1 C102.2 C103.1 C104.1 C105.1 C106.2 C115.1 C119.1 C140.1 C144.1 LED1.1 P1.3 R10.2 R11.2 R14.2 R15.2 R26.2 R31.2 R32.2 R35.2 R64.1 R69.2 R70.2 R71.2 R72.2 R83.2 R88.2 R89.2 R90.2 R102.2 R107.2 R108.2 R109.2 U2.31 U2.33 U2.41 U2.49 U2.51 U2.52 U3.31 U3.33 U3.41 U3.49 U3.51 U3.52 U7.10 U7.19 U7.26 U7.49 U7.74 U7.99 U8.2 U9.4 U9.9 U9.14 U9.15 U9.16 U9.21 U9.25 U9.26 U9.27 U9.28 U9.29 U9.30 U9.32 U9.33 U10.31 U10.33 U10.41 U10.49 U10.51 U10.52 U11.3 U13.3 U13.6 U15.31 U15.33 U15.41 U15.49 U15.51 U15.52 U16.31 U16.33 U16.41 U16.49 U16.51 U16.52
GND: CN1.2 PowerBAT1.1 Q1.1
BAT: C61.1 C90.1 R63.2 SW1.1 U6.3 U11.2
BIAS: C2.1 C44.1 C75.1 C110.1 C150.1 R5.2 R44.2 R66.2 R76.2 R117.2 U2.63 U3.63 U10.63 U12.1 U15.63 U16.63
CLK1: U2.37 U9.1
CLK2: U3.37 U9.3
CLK3: U9.5 U15.37
CLK4: U9.7 U16.37
CLK5: U9.8 U10.37
CLK6: U9.17
CLK7: U9.18
CLK8: U9.20
CLK9: U9.22
CLK10: U7.12 U9.24
CS1: U2.39 U7.28
CS2: U3.39 U7.32
CS3: U7.51 U15.39
CS4: U7.52 U16.39
CS5: U7.77 U10.39
CS6: U7.80
CS7: U7.3
CS8: U7.2
CS9: U7.85
CS10: U7.84
DRDY1: U2.47 U7.33
DRDY2: U3.47 U7.34
DRDY3: U7.53 U15.47
DRDY4: U7.54 U16.47
DRDY5: U7.81 U10.47
DRDY6: U7.82
DRDY7: U7.97
DRDY8: U7.96
DRDY9: U7.87
DRDY10: U7.86
E1: R6.1 R40.1 R47.1 R77.1 R115.1 U1.1 U4.1 U5.1 U14.1 U17.1
E2: R13.1 R37.1 R49.1 R84.1 R114.1 U1.2 U4.2 U5.2 U14.2 U17.2
E3: R17.1 R30.1 R51.1 R92.1 R106.1 U1.3 U4.3 U5.3 U14.3 U17.3
E4: R20.1 R28.1 R53.1 R93.1 R96.1 U1.4 U4.4 U5.4 U14.4 U17.4
E5: R19.1 R33.1 R55.1 R85.1 R103.1 U1.5 U4.5 U5.5 U14.5 U17.5
E6: R9.1 R39.1 R57.1 R87.1 R111.1 U1.6 U4.6 U5.6 U14.6 U17.6
E7: R4.1 R42.1 R59.1 R82.1 R116.1 U1.7 U4.7 U5.7 U14.7 U17.7
E8: R2.1 R46.1 R61.1 R73.1 R119.1 U1.8 U4.8 U5.8 U14.8 U17.8
IN1N: C9.2 C35.2 C49.2 C117.2 C141.2 R7.2 R38.2 R48.2 R78.2 R113.2 U2.15 U3.15 U10.15 U15.15 U16.15
IN1P: C9.1 C35.1 C49.1 C117.1 C141.1 R6.2 R40.2 R47.2 R77.2 R115.2 U2.16 U3.16 U10.16 U15.16 U16.16
IN2N: C19.2 C32.2 C50.2 C126.2 C133.2 R16.2 R34.2 R50.2 R91.2 R105.2 U2.13 U3.13 U10.13 U15.13 U16.13
IN2P: C19.1 C32.1 C50.1 C126.1 C133.1 R13.2 R37.2 R49.2 R84.2 R114.2 U2.14 U3.14 U10.14 U15.14 U16.14
IN3N: C20.2 C24.2 C51.2 C128.2 C131.2 R21.2 R29.2 R52.2 R94.2 R95.2 U2.11 U3.11 U10.11 U15.11 U16.11
IN3P: C20.1 C24.1 C51.1 C128.1 C131.1 R17.2 R30.2 R51.2 R92.2 R106.2 U2.12 U3.12 U10.12 U15.12 U16.12
IN4N: C22.2 C23.2 C52.2 C129.2 C130.2 R18.2 R27.2 R54.2 R97.2 R104.2 U2.9 U3.9 U10.9 U15.9 U16.9
IN4P: C22.1 C23.1 C52.1 C129.1 C130.1 R20.2 R28.2 R53.2 R93.2 R96.2 U2.10 U3.10 U10.10 U15.10 U16.10
IN5N: C21.2 C27.2 C53.2 C127.2 C132.2 R12.2 R36.2 R56.2 R86.2 R110.2 U2.7 U3.7 U10.7 U15.7 U16.7
IN5P: C21.1 C27.1 C53.1 C127.1 C132.1 R19.2 R33.2 R55.2 R85.2 R103.2 U2.8 U3.8 U10.8 U15.8 U16.8
IN6N: C16.2 C34.2 C54.2 C118.2 C139.2 R8.2 R41.2 R58.2 R81.2 R112.2 U2.5 U3.5 U10.5 U15.5 U16.5
IN6P: C16.1 C34.1 C54.1 C118.1 C139.1 R9.2 R39.2 R57.2 R87.2 R111.2 U2.6 U3.6 U10.6 U15.6 U16.6
IN7N: C10.2 C39.2 C55.2 C109.2 C149.2 R3.2 R43.2 R60.2 R75.2 R120.2 U2.3 U3.3 U10.3 U15.3 U16.3
IN7P: C10.1 C39.1 C55.1 C109.1 C149.1 R4.2 R42.2 R59.2 R82.2 R116.2 U2.4 U3.4 U10.4 U15.4 U16.4
IN8N: C1.2 C45.2 C56.2 C108.2 C151.2 R1.2 R45.2 R62.2 R74.2 R118.2 U2.1 U3.1 U10.1 U15.1 U16.1
IN8P: C1.1 C45.1 C56.1 C108.1 C151.1 R2.2 R46.2 R61.2 R73.2 R119.2 U2.2 U3.2 U10.2 U15.2 U16.2
MISO1: U2.43 U3.43 U7.30
MISO2: U7.17 U15.43 U16.43
MISO3: U7.79 U10.43
MISO4: U7.4
MISO5: U7.90
MOSI1: U2.34 U3.34 U7.31
MOSI2: U7.16 U15.34 U16.34
MOSI3: U7.36 U10.34
MOSI4: U7.5
MOSI5: U7.91
OSC: R65.2 U9.13
PA13: U7.72 U13.2
PA14: U7.76 U13.4
PB8: P1.1 R68.1 U7.95
REF: R1.1 R3.1 R7.1 R8.1 R12.1 R16.1 R18.1 R21.1 R27.1 R29.1 R34.1 R36.1 R38.1 R41.1 R43.1 R45.1 R48.1 R50.1 R52.1 R54.1 R56.1 R58.1 R60.1 R62.1 R74.1 R75.1 R78.1 R81.1 R86.1 R91.1 R94.1 R95.1 R97.1 R104.1 R105.1 R110.1 R112.1 R113.1 R118.1 R120.1 U12.2
RESET: U7.14 U13.5
RX: P1.5 U7.23
SCLK1: U2.40 U3.40 U7.29
SCLK2: U7.46 U15.40 U16.40
SCLK3: U7.78 U10.40
SCLK4: U7.1
SCLK5: U7.89
START: U2.38 U3.38 U7.35 U10.38 U15.38 U16.38
TX: P1.4 U7.22
$1N4527: C48.1 U7.73
$1N4585: R64.2 U7.94
$1N4638: C65.1 U7.48
$1N4732: PowerBAT1.2 R63.1
$1N4759: R23.2 R24.2 R80.2 R100.2 R101.2 U2.36 U3.36 U10.36 U15.36 U16.36
$1N4761: R22.2 R25.2 R79.2 R98.2 R99.2 U2.35 U3.35 U10.35 U15.35 U16.35
$1N7784: C101.2 L1.2 U7.21
$1N9609: R65.1 U8.3
$1N10274: LED1.2 R67.2
$1N10295: P1.6 R67.1
$1N10676: Q1.3 SW1.2
$1N10712: CN1.1 Q1.2
$1N11001: R14.1 R32.1 R70.1 R88.1 R108.1 U2.44 U3.44 U10.44 U15.44 U16.44
$1N11004: R10.1 R35.1 R72.1 R83.1 R109.1 U2.46 U3.46 U10.46 U15.46 U16.46
$1N11007: R11.1 R31.1 R71.1 R89.1 R107.1 U2.45 U3.45 U10.45 U15.45 U16.45
$1N11015: R15.1 R26.1 R69.1 R90.1 R102.1 U2.42 U3.42 U10.42 U15.42 U16.42
$1N12604: C14.1 C29.1 C80.1 C122.1 C136.1 U2.26 U3.26 U10.26 U15.26 U16.26
$1N12673: C13.1 C30.1 C96.1 C121.1 C137.1 U2.30 U3.30 U10.30 U15.30 U16.30
$1N12768: C12.1 C31.1 C107.1 C120.1 C138.1 U2.28 U3.28 U10.28 U15.28 U16.28
$1N13215: C8.1 C15.1 C28.1 C36.1 C76.1 C77.1 C116.1 C123.1 C142.1 C143.1 U2.24 U3.24 U10.24 U15.24 U16.24
$1N13777: C4.1 C5.1 C41.1 C42.1 C98.1 C99.1 C112.1 C113.1 C146.1 C147.1 U2.55 U3.55 U10.55 U15.55 U16.55
$1N14600: C2.2 C44.2 C75.2 C110.2 C150.2 R5.1 R44.1 R66.1 R76.1 R117.1 U2.61 U3.61 U10.61 U15.61 U16.61

Pads without a net: SW1 3; U2 17 18 27 29 60 62 64; U3 17 18 27 29 60 62 64; U7 6 7 8 9 13 15 18 20 24 25 37 38 39 40 41 42 43 44 45 47 55 56 57 58 59 60 61 62 63 64 65 66 67 68 69 70 71 83 88 92 93 98; U8 1; U9 11 12; U10 17 18 27 29 60 62 64; U15 17 18 27 29 60 62 64; U16 17 18 27 29 60 62 64

## Via types
v1: diameter 0.75, hole 0.5, Top Layer to Bottom Layer, 10 vias
v2: diameter 1.5, hole 1, Top Layer to Bottom Layer, 32 vias
v3: diameter 0.61, hole 0.305, Top Layer to Bottom Layer, 117 vias
v4: diameter 0.65, hole 0.4, Top Layer to Bottom Layer, 94 vias

## Routing (per net, layer and track width the routed paths; a pad name or vN(x,y) marks a point on that pad's centre or on a via; arc(x,y) is an arc through that point)
+3.3V: length 208.4
  Top Layer w0.254: U10.48 114.75,35.61 C103.2 ; C144.2 72.87,6.26 73.25,6.63 73.25,7.49 U16.50 ; C37.2 67.03,65.22 67.4,65.6 67.4,66.45 U3.50 ; U16.48 69.57,9.37 C140.2 ; U9.31 81.67,48.32 83.06,49.72 83.06,50.69 C68.2 80.83,50.12 80.36,50.12 80.12,49.87 U9.2 ; U9.6 78.04,49.59 78.04,50.49 77.79,50.74 C67.1 ; 35.89,22.74 35.97,22.82 35.97,23.68 36.34,24.05 C115.2 ; C89.1 81.38,43.01 80.12,44.28 U9.23 ; C7.2 30.5,83.02 30.13,82.64 30.13,81.79 U2.50 ; U3.48 63.73,68.33 C33.2 ; C87.2 77.28,44.03 77.87,44.03 78.12,44.27 U9.19 ; U2.48 33.81,79.91 C11.2 ; C104.2 117.86,38.92 117.49,39.29 116.63,39.29 U10.50 ; U9.10 75.79,48.32 C71.2 ; 39.75,20.84 39.65,20.94 U15.48
  Top Layer w0.3: C92.1 47.06,37.68 47.06,38.59 46.7,38.94 46.7,39.73 U7.11 ; C83.1 38.9,40.02 U7.100 ; U7.27 57.47,41.83 C84.1 ; U7.75 41.75,55.4 C47.1 ; C57.1 55.72,53.33 U7.50
  Top Layer w0.5: C87.2 76.04,42.47 C94.1 ; C71.2 74.23,49.89 C66.1 ; C37.2 65.95,64.63 v1(65.4,64.08) ; C73.1 67.06,46.48 U8.4 ; C7.2 31.59,83.61 v1(32.13,84.16) ; C144.2 71.79,5.66 v1(71.24,5.12) ; C88.2 81.62,42.98 C89.1 ; C68.2 82.08,51.67 82.08,53.17 ; C57.1 59.03,55.01 C58.2 ; v1(36.22,81.07) 34.96,79.8 C11.2 ; 39.75,20.84 40.8,20.84 v1(42.07,22.11) ; C104.2 118.46,37.83 v1(119,37.29) ; C85.2 59.14,41.85 C84.1 ; v1(37.97,25.19) 37.43,24.65 C115.2 ; C83.1 37.94,40.05 C82.2 ; 47.06,35.89 47.18,36.02 C92.1 ; C106.1 67.76,31.84 C105.2 67.91,28.77 P1.2 ; v1(67.15,8.21) 68.42,9.47 C140.2 ; C46.2 40.22,56.96 C47.1 ; C103.2 114.65,34.46 v1(115.91,33.19) ; C64.2 77.79,52.51 C67.1 ; C33.2 62.57,68.44 v1(61.31,67.17)
  Top Layer w0.75: C40.1 40.22,60.33 C46.2 ; C64.2 77.25,55.92 C60.1 ; C85.2 60.39,41.75 C86.1 ; C66.1 72.52,49.65 C63.1 ; 47.06,35.89 48.7,34.24 C102.1 ; C93.1 76.04,40.81 C94.1 ; C81.1 34.33,38.32 C82.2 ; C58.2 61,54.73 C59.1 ; 82.08,53.17 82.08,53.21 C70.1 ; C88.2 81.62,39.92 C95.1 ; C73.1 65.79,45.21 C72.1
  Top Layer w1: C72.1 64.77,47.55 ; 64.77,47.55 v2(64.77,47.96) 68.64,47.96 C63.1 ; 64.77,47.55 61.68,44.46 C86.1 ; v2(4.32,35.77) 3.05,34.5 U13.1 ; v2(69.22,34.63) 70.52,33.33 R68.2 ; v2(69.22,34.63) 68.17,33.59 C106.1 ; v2(69.22,34.63) 73.03,38.44 C93.1 ; v2(79.88,36.41) 80.65,37.17 C95.1 ; v2(36.83,61.66) 38.85,61.66 C40.1 ; R100.1 52.41,16.2 v2(53.47,15.13) 52.43,14.09 R99.1 ; R101.1 56.8,14.12 v2(55.74,15.18) 56.78,16.22 R98.1 ; v2(31.37,37.3) 32.51,37.3 C81.1 ; R79.1 107.9,22.83 v2(108.94,21.79) 110,22.85 R80.1 ; C102.1 49.9,33.48 v2(50.55,34.12) 52,34.12 52.07,34.06 ; U11.1 24.46,38.8 C91.1 v2(25.27,41.99) ; R22.1 46.59,73.05 v2(47.63,74.1) 46.57,75.16 R23.1 ; R25.1 50.94,75.19 v2(49.9,74.14) 50.96,73.08 R24.1 ; C70.1 86.11,55.71 ; v2(78.87,56.22) C60.1 ; C59.1 62.36,56.09 v2(64.9,56.09)
  vias: v2(86.49,55.71)
+5V: length 157.6
  Top Layer w0.252: U16.54 75.33,6.37 74.46,5.5 ; U2.54 28.05,82.91 C6.2 ; 33.89,22.74 33.89,23.94 C114.2 ; U10.54 117.75,41.37 C97.2 ; C38.2 69.49,65.33 U3.54
  Top Layer w0.254: 25.05,69.11 C26.1 24.73,68.19 22.51,65.97 v2(22.51,65.52) 21.72,66.31 21.72,68.32 C25.1 22.1,68.66 22.48,69.04 22.48,71.39 22.87,71.79 23.72,71.79 23.97,71.54 23.97,70.69 U2.19 ; 25.05,69.11 U2.21 ; 25.05,69.11 25.55,69.61 U2.22 ; 31.39,22.74 31.39,24.37 C111.2 ; U10.54 116.47,41.45 115.62,41.45 115.37,41.7 115.37,42.05 115.62,42.29 116.47,42.29 U10.56 ; U10.22 104.45,43.87 103.95,44.37 ; C6.2 29.7,84.56 29.78,84.56 29.94,84.72 29.94,84.8 31.75,86.61 v2(31.75,86.83) ; 103.95,44.37 C78.1 103.03,44.69 100.81,46.91 v2(100.36,46.91) 101.16,47.7 103.16,47.7 C74.1 103.51,47.31 103.88,46.94 106.23,46.94 106.63,46.55 106.63,45.7 106.38,45.45 105.53,45.45 U10.19 ; 103.95,44.37 U10.21 ; 33.89,22.74 33.81,22.66 33.81,21.81 33.56,21.56 33.22,21.56 32.97,21.81 32.97,22.66 32.89,22.74 ; C97.2 119.4,39.72 119.4,39.64 119.56,39.48 119.64,39.48 121.45,37.67 v2(121.67,37.67) ; C79.2 118.18,43.87 U10.59 ; U2.54 27.97,81.63 27.97,80.77 27.72,80.53 27.37,80.53 27.13,80.77 27.13,81.63 U2.56 ; C3.2 25.55,83.34 U2.59 ; 30.89,10.15 C135.1 30.57,9.22 28.35,7 v2(28.35,6.56) 27.56,7.35 27.56,9.36 27.9,9.7 27.95,9.7 28.32,10.07 28.32,12.43 28.72,12.82 29.56,12.82 29.81,12.58 29.81,11.72 U15.19 ; 30.89,10.15 U15.21 ; 30.89,10.15 31.39,10.65 U15.22 ; v2(37.59,27.86) 37.59,27.64 35.78,25.83 35.78,25.76 35.62,25.59 35.54,25.59 C114.2 ; 72.49,79.13 71.99,78.63 U3.22 ; 72.49,79.13 C17.1 72.8,80.05 75.02,82.27 v2(75.02,82.72) 75.81,81.93 75.81,79.92 75.47,79.58 75.43,79.58 75.06,79.2 75.06,76.85 74.66,76.45 73.81,76.45 73.57,76.7 73.57,77.55 U3.19 ; 72.49,79.13 U3.21 ; 74.46,5.5 73.68,4.72 73.6,4.72 73.44,4.55 73.44,4.48 71.62,2.67 v2(71.62,2.45) ; U16.22 77.83,19.66 78.33,20.16 ; U16.19 79.41,18.59 79.41,17.73 79.65,17.49 80.5,17.49 80.9,17.88 80.9,20.24 81.27,20.61 C125.1 81.66,20.95 81.66,22.96 v2(80.86,23.75) 80.86,23.31 78.65,21.09 C124.1 78.33,20.16 ; U16.54 75.41,7.65 75.41,8.5 75.65,8.75 76,8.75 76.25,8.5 76.25,7.65 U16.56 ; C148.2 77.83,5.94 U16.59 ; U3.56 70.4,66.61 70.4,67.47 70.16,67.71 69.81,67.71 69.57,67.47 69.57,66.61 U3.54 ; U3.59 71.99,64.9 C43.2 ; C38.2 67.83,63.68 67.76,63.68 67.59,63.52 67.59,63.44 65.78,61.63 v2(65.78,61.41) ; 78.33,20.16 U16.21 ; 26.85,52.32 U6.1
  Top Layer w0.5: C79.2 118.46,44.15 v2(120.02,44.15) ; v2(78.1,4.1) 78.1,5.66 C148.2 ; v2(25.27,85.17) 25.27,83.61 C3.2 ; v2(31.11,26.21) 31.11,24.65 C111.2 ; v2(72.26,63.06) 72.26,64.63 C43.2
  Top Layer w1: v2(32.13,52.28) 30.13,52.28 C62.1 29.9,52.11 U6.1
AGND: length 191.2
  Top Layer w0.252: 73.56,5.54 C145.1 ; 67.72,64.5 67.52,64.46 ; 35.66,24.77 C114.1 ; 29.82,83.74 C6.1 ; 118.58,39.6 C97.1
  Top Layer w0.254: v4(76.96,25.82) 76.51,25.37 C116.2 75.88,24.05 75.88,19.97 76.25,19.6 76.25,18.75 U16.25 ; v4(31.11,8.91) 31.66,9.46 C135.2 31.89,10.06 U15.23 ; U2.20 24.55,69.75 24.22,69.43 23.92,69.43 C25.2 22.73,68.25 v4(22.73,67.39) ; 71.08,64.72 70.99,64.81 U3.57 ; 71.08,64.72 70.99,64.63 v4(70.99,63.57) ; 71.08,64.72 71.49,65.12 U3.58 ; 32.39,22.74 32.39,24.47 C111.1 ; C96.2 102.44,39.44 v4(101.22,39.44) ; U10.23 103.86,43.37 C78.2 103.27,43.6 v4(102.72,44.15) ; C3.1 26.05,83.12 U2.58 ; C3.1 26.54,83.61 v4(26.54,84.67) ; C3.1 26.55,83.43 U2.57 ; C145.1 72.48,4.61 v4(72.13,4.61) ; C30.2 29.98,67.6 v4(29.98,66.38) ; v4(65.23,77.67) 65.26,77.63 U3.32 ; v4(72.26,80.36) 71.71,79.82 C17.2 71.49,79.22 U3.23 ; v4(32.26,4.49) 32.7,4.94 C142.2 33.33,6.26 C143.2 33.33,10.34 32.97,10.71 32.97,11.56 U15.25 ; v4(71.07,18.71) 71.11,18.67 U16.32 ; C147.2 74.89,3.78 74.89,3.52 74.73,3.36 74.48,3.36 74.16,3.05 v4(74.16,1.31) ; 76.92,5.75 77.33,6.16 U16.58 ; 76.92,5.75 76.83,5.85 U16.57 ; 76.92,5.75 76.83,5.66 v4(76.83,4.61) ; v4(68.32,60.27) C41.2 68.32,62.01 68.63,62.32 68.89,62.32 69.05,62.49 69.05,62.74 C42.2 ; v4(74.67,22.9) C122.2 ; C121.2 73.39,21.68 v4(73.39,22.9) ; v4(119.51,38.18) 119.51,38.52 C97.1 ; v4(28.58,8.43) 28.58,9.28 C134.2 29.76,10.46 30.06,10.46 30.39,10.79 U15.20 ; v4(122.81,40.21) C99.2 121.07,40.21 120.76,40.52 120.76,40.77 120.6,40.94 120.34,40.94 C98.2 ; C79.1 118.27,42.87 U10.57 ; C79.1 118.46,42.88 v4(119.51,42.88) ; C79.1 117.96,43.37 U10.58 ; C111.1 32.39,24.65 v4(32.39,25.7) ; C111.1 31.89,24.15 31.89,22.74 ; v4(34.54,7.41) 34.54,8.65 ; v4(71.12,84.78) 70.67,84.34 C8.2 70.04,83.01 C15.2 70.04,78.93 70.4,78.57 70.4,77.71 U3.25 ; U2.32 32.27,70.61 v4(32.31,70.57) ; v4(102.24,46.69) 103.09,46.69 C74.2 104.27,45.5 104.27,45.2 104.6,44.87 U10.20 ; U10.25 105.37,42.29 104.51,42.29 104.15,41.93 C77.2 100.07,41.93 C76.2 98.75,42.56 v4(98.3,43) ; v4(68.83,81.86) C14.2 ; U16.20 78.83,19.52 79.15,19.85 79.46,19.85 80.22,20.61 80.64,21.03 v4(80.64,21.88) ; U16.53 74.83,6.55 74.57,6.3 74.06,6.3 73.56,5.79 73.56,5.54 ; v4(105.41,37.11) 105.45,37.15 U10.32 ; 29.82,83.74 29.82,83.48 29.31,82.98 28.8,82.98 28.55,82.72 U2.53 ; v4(78.1,21.4) 77.56,20.85 C124.2 77.33,20.25 U16.23 ; U15.32 38.11,11.64 v4(38.15,11.6) ; C114.1 36.74,25.7 v4(37.08,25.7) ; v4(35.83,7.41) 35.83,8.64 35.81,8.65 ; U3.53 68.99,65.52 68.73,65.26 68.22,65.26 67.72,64.75 67.72,64.5 ; v4(31.24,84.67) 30.9,84.67 C6.1 ; v4(66.29,63.57) 66.63,63.57 67.52,64.46 ; v4(67.55,81.86) 67.55,80.64 C13.2 ; v4(28.7,66.38) C29.2 ; U2.23 26.05,69.02 C26.2 25.82,68.42 v4(25.27,67.88) ; v4(29.21,87.97) C5.2 29.21,86.23 28.9,85.92 28.64,85.92 28.48,85.75 28.48,85.5 C4.2 ; C112.2 34.32,26.53 34.32,26.79 34.49,26.95 34.74,26.95 35.05,27.26 C113.2 v4(35.05,29) ; 34.39,22.74 34.39,23.76 34.64,24.01 35.15,24.01 35.66,24.52 35.66,24.77 ; v4(101.22,40.72) C80.2 ; v4(74.8,80.84) 74.8,79.99 C18.2 73.62,78.81 73.31,78.81 72.99,78.48 U3.20 ; 118.58,39.6 118.33,39.6 117.82,40.11 117.82,40.62 117.57,40.87 U10.53 ; U2.25 27.13,70.53 27.13,69.67 27.49,69.31 C28.2 27.49,65.23 C36.2 26.86,63.9 v4(26.42,63.46)
  Top Layer w0.4: C31.2 v4(44.4,68.79) ; 55.91,79.45 v4(53.13,79.45) ; C138.2 v4(50.24,9.83) ; C61.2 25.14,49.41 25.15,49.4 29.64,49.4 C62.2 30.27,49.11 v4(32.13,49.11) ; 103.64,27.8 v4(103.64,25.02) ; C120.2 v4(58.98,20.48)
DGND: length 264.4
  Top Layer w0.254: R26.2 60.52,72.93 60.99,73.39 61.79,73.39 63.35,71.83 U3.41 ; R26.2 60.07,72.84 v4(59.31,72.08) ; R26.2 R32.2 R31.2 60.57,70 R35.2 ; v4(111,31.19) 110.24,31.95 R69.2 ; C87.1 78.68,44.03 78.87,44.03 79.12,44.27 U9.21 ; P1.3 66.51,29.91 C105.1 66.67,31.84 C106.2 ; v4(63.75,65.48) 64,65.22 C37.1 66.16,66.53 U3.49 67.05,66.59 67.05,66.6 67.07,66.62 67.07,67.47 67.31,67.71 67.66,67.71 67.9,67.47 67.9,66.61 U3.51 U3.52 ; R10.2 36.96,78.24 R11.2 R14.2 R15.2 ; R69.2 R70.2 R71.2 113.08,32.46 114.37,32.46 ; R69.2 110.16,32.41 109.69,32.88 109.69,33.67 111.25,35.23 U10.41 ; C140.1 69.47,7.78 v4(68.96,7.28) ; v4(106.94,39.32) 105.5,39.32 U10.31 ; R15.2 37.01,75.31 36.54,74.85 35.75,74.85 34.18,76.41 U2.41 ; R15.2 37.47,75.39 v4(38.23,76.16) ; C11.1 33.91,81.49 v4(34.42,82) ; v4(70.1,17.56) 70.79,16.87 U16.33 ; R90.2 42.85,16.35 42.38,15.88 41.59,15.88 40.03,17.44 U15.41 ; R90.2 R88.2 R89.2 42.8,19.27 42.8,20.56 ; R90.2 43.31,16.43 v4(44.07,17.19) ; U15.33 38.42,13.44 v4(39.12,12.75) ; U9.16 77.12,45.32 77.62,45.82 U9.15 ; v4(106.56,36.14) 107.25,36.84 U10.33 ; U16.52 U16.51 73.75,7.65 73.75,8.5 73.5,8.75 73.15,8.75 72.91,8.5 72.91,7.65 72.89,7.63 72.89,7.63 U16.49 72.01,7.57 C144.1 69.85,6.26 v4(69.59,6.51) ; v4(63.12,66.24) 63.62,66.75 C33.1 ; v4(64.26,76.53) 64.95,75.83 U3.33 ; C47.2 42.25,56.3 U7.74 ; v4(35.94,13.13) 35.94,11.69 U15.31 ; C68.1 80.71,51.39 80.71,51.22 80.52,51.04 79.5,51.04 79.22,50.75 79.22,50.36 79.11,50.25 79.11,49.51 U9.4 79.12,47.32 ; C103.1 116.34,35.51 v4(116.84,35) ; U7.99 40.13,41.76 39.37,41.76 39.04,41.42 C83.2 ; U9.32 80.62,48.82 79.62,47.82 U9.30 U9.29 U9.28 U9.27 U9.26 U9.25 ; U3.31 67.43,77.58 v4(67.43,76.15) ; 78.12,46.32 U9.14 ; R102.2 R108.2 R107.2 66.41,11.04 R109.2 ; R102.2 66.37,13.96 66.83,14.43 67.63,14.43 69.19,12.87 U16.41 ; R102.2 65.91,13.88 v4(65.15,13.12) ; v4(33.78,82.76) 33.53,83.02 C7.1 31.37,81.71 U2.49 30.48,81.64 30.48,81.64 30.47,81.62 30.47,80.77 30.22,80.53 29.87,80.53 29.63,80.77 29.63,81.63 U2.51 U2.52 ; U2.31 30.1,70.66 v4(30.1,72.09) ; v4(33.27,71.71) 32.58,72.41 U2.33 ; U7.49 56.62,52.83 C57.2 ; U16.31 73.28,18.62 v4(73.28,17.18) ; U10.52 U10.51 116.47,39.79 115.62,39.79 115.37,39.55 115.37,39.2 115.62,38.95 116.47,38.95 116.49,38.93 116.49,38.93 U10.49 116.55,38.05 C104.1 117.86,35.89 v4(117.61,35.64) ; U9.9 77.12,48.82 U9.33 78.99,47.07 v4(80.39,45.68) ; v4(40.26,23.03) 39.75,22.53 C119.1 ; 34.89,22.74 35.39,22.74 35.47,22.66 35.47,21.81 35.72,21.56 36.06,21.56 36.31,21.81 36.31,22.66 36.33,22.68 36.33,22.68 36.39,22.74 37.21,22.74 C115.1 39.37,24.05 v4(39.62,23.8)
  Top Layer w0.3: U9.9 76.39,48.87 76.39,49.13 75.9,49.62 75.89,49.62 75.55,49.96 ; C67.2 76.39,50.8 75.55,49.96 ; U7.10 46.25,38.02 C92.2 ; U7.26 56.18,40.45 C84.2 ; C57.2 59.28,53.61 C58.1 ; C47.2 41.61,58.59 C46.1 ; C83.2 37.69,41.14 C82.1 ; C71.1 74.92,50.6 74.92,50.59 75.55,49.96 ; U7.19 50.75,37.69 C101.1 ; C87.1 77.13,42.47 C94.2
  Top Layer w0.4: v4(31.62,42.38) 33.27,42.38 C81.2 35.1,42.11 C82.1 ; U9.25 83,43.63 C89.2 82.71,42.73 C88.1 84.45,39.5 C95.2 84.96,38.44 v4(85.85,38.44) ; v4(34.42,44.27) 35.82,44.27 R64.1 ; v4(58.42,45.99) C65.2 ; v4(26.92,36.15) 25.36,36.15 C91.2 24.71,36.8 U11.3 21.16,36.24 C90.2 ; LED1.1 60.13,35.95 v4(61.59,37.42) 61.59,39.16 ; C92.2 45.78,36.07 C100.1 45.97,34.53 C102.2 44.79,33.36 v4(43.56,33.36) ; 70.95,44.88 68.92,42.85 C73.2 66.04,42.85 C72.2 64.61,44.28 v4(63.63,44.28) ; C101.1 50.67,37.48 v4(50.67,36.28) ; v4(43.05,63.46) 43.05,62.07 C40.2 42.67,60.24 C46.1 ; C67.2 76.39,52.82 C64.1 73.16,56.05 C60.2 72.78,56.6 v4(71.56,56.6) ; C86.2 60.27,40.66 C85.1 59.02,40.45 C84.2 ; U13.6 v4(4.06,21.8) ; v4(77.85,36.66) 77.85,38.05 C93.2 77.46,40.64 C94.2 ; v4(80.52,57.49) 80.78,57.23 C70.2 80.99,55.5 C69.2 80.99,51.67 C68.1 ; v4(70.36,54.79) 70.36,53.48 C63.2 ; 70.33,53.41 C66.2 72.89,51.11 C71.1 ; v4(45.47,62.54) C48.2 ; C58.1 60.75,53.64 C59.2 v4(62.23,50.76)
  Low-Speed Digital Signals w0.4: U13.3 3.94,29.42
GND: length 25.8
  Top Layer w0.254: CN1.2 10.65,39.09 Q1.1
  Top Layer w0.4: CN1.2 3.67,39.09 3.04,39.72 3.04,54.05 3.8,54.81 PowerBAT1.1
BAT: length 34
  Top Layer w0.75: R63.2 13.84,53.73 SW1.1
  Top Layer w1: U11.2 17.45,38.8 C90.1 13.84,42.41 SW1.1 14.43,52.11 C61.1 23.64,52.11 U6.3
BIAS: length 260.8
  Top Layer w0.252: 79.83,6.72 79.83,6.55 80.59,5.79 82.11,5.79 82.6,5.31 R117.2 ; v3(107.4,45.11) 114.94,45.11 115.62,45.79 116.47,45.79 U10.63 ; R44.2 76.76,64.27 76.27,64.75 74.75,64.75 73.99,65.52 73.99,65.68 ; 117.4,45.87 117.57,45.87 118.33,46.63 118.33,48.16 118.81,48.64 R66.2 ; 23.55,82.56 23.55,82.66 23.32,82.89 21.79,82.89 20.78,83.9 R5.2 ; 29.39,23.59 29.39,23.69 29.16,23.92 27.63,23.92 26.62,24.94 R76.2 ; U3.63 73.99,68.61 66.22,76.37 65.46,76.37 64.69,77.14 51.23,77.14 48.69,74.59 48.69,73.58 45.14,70.02 33.71,70.02 32.44,71.29 31.93,71.29 23.55,79.67 U2.63 ; v3(79.83,16.9) U16.63
  Top Layer w0.254: U10.63 117.4,45.87 117.73,46.2 117.73,47.45 118.62,48.34 118.7,48.34 R66.2 120.16,48.64 C75.1 ; v3(76.87,57.98) C44.1 76.76,62.92 R44.2 76.45,64.38 76.45,64.47 75.57,65.35 74.31,65.35 73.99,65.68 U3.63 ; R5.2 20.66,84.27 C2.1 20.78,85.32 R5.2 ; R5.2 21.08,83.85 21.08,83.77 21.97,82.89 23.22,82.89 23.55,82.56 U2.63 ; 37.52,70.02 37.52,64.18 33.2,59.86 33.2,45.39 27.61,39.8 27.61,27.57 C110.1 ; R76.2 26.62,26.35 C110.1 ; R76.2 26.92,24.89 26.92,24.81 27.81,23.92 27.81,23.92 29.06,23.92 29.39,23.59 29.39,22.74 ; R76.2 26.51,25.31 C110.1 ; C150.1 82.6,3.96 R117.2 82.29,5.42 82.29,5.5 81.41,6.39 80.15,6.39 79.83,6.72 U16.63
  Analog Signals w0.252: 76.87,45.79 77.38,46.3 80.68,46.3 81.87,45.11 v3(107.4,45.11) ; v3(79.83,16.9) 79.83,30.62 U12.1
  Analog Signals w0.254: U12.1 76.87,33.58 76.87,46.3 75.85,47.32 75.85,56.97 v3(76.87,57.98)
CLK1: length 62.4
  Top Layer w0.254: v3(82.47,50.13) 81.85,49.51 U9.1 ; v3(33.82,74.49) 33.74,74.41 U2.37
  High-Speed Digital Signals w0.254: v3(82.47,50.13) 80.45,52.15 80.07,52.15 57.74,74.49 v3(33.82,74.49)
CLK2: length 32.4
  Top Layer w0.254: v3(78.9,51.42) 79.63,52.15 v3(79.63,53.55) ; U3.37 67.43,73.83 v3(67.52,73.75) ; U9.3 79.62,50.2 v3(79.87,50.45)
  High-Speed Digital Signals w0.254: v3(79.63,53.55) 79.63,61.64 v3(67.52,73.75) ; v3(79.87,50.45) v3(78.9,51.42)
CLK3: length 66.7
  Top Layer w0.254: v3(40.56,15.53) 40.47,15.44 U15.37 ; v3(78.63,50.6) 78.62,50.58 U9.5
  High-Speed Digital Signals w0.254: v3(78.63,50.6) 78.63,47.61 81.97,44.27 81.97,43.79 78.91,40.72 72.13,40.72 62.97,31.56 62.97,30.78 63.19,30.55 63.19,30.07 62.85,29.73 59.83,29.73 59.57,29.98 56.93,29.98 56.15,29.2 56.15,28.29 45.85,17.99 43.02,17.99 v3(40.56,15.53)
CLK4: length 44.7
  Top Layer w0.254: v3(72.39,14.94) 72.31,14.87 U16.37 ; v3(75.56,14.91) v3(73.93,14.91) ; v3(78.49,42.5) 78.49,39.95 78.69,39.74 78.69,36.1 80.91,33.89 v3(80.91,30.83) ; U9.7 77.62,50.08 v3(77.34,50.36)
  High-Speed Digital Signals w0.254: v3(75.56,14.91) 79.84,19.18 79.84,24.18 80.91,25.25 v3(80.91,30.83) ; v3(77.34,50.36) 77.34,43.64 v3(78.49,42.5) ; v3(73.93,14.91) 72.42,14.91 v3(72.39,14.94)
CLK5: length 46.9
  Top Layer w0.254: v3(107.06,41.23) 107.31,40.98 107.31,39.86 109.22,37.96 109.22,37.1 ; U9.8 77.12,49.55 v3(76.58,50.09)
  High-Speed Digital Signals w0.254: v3(107.06,41.23) 106.93,41.36 106.68,41.36 105.54,42.5 98.66,42.5 98.55,42.4 98.05,42.4 97.95,42.5 83.91,42.5 82.46,43.96 82.46,44.54 82.04,44.96 82.04,49.11 79.12,52.03 75.82,52.03 75.56,51.77 75.56,51.36 76.58,50.34 v3(76.58,50.09)
CLK10: length 38.3
  Top Layer w0.254: U7.12 47.25,41.08 v3(47.25,41.08) ; U9.24 81.23,44.03 v3(81.39,44.03)
  High-Speed Digital Signals w0.254: 81.41,44.03 78.46,41.08 53.08,41.08 52.5,41.66 52.01,41.66 51.25,40.9 48.02,40.9 47.84,41.08 v3(47.25,41.08)
CS1: length 50.2
  Top Layer w0.254: v3(54,42.48) 54.25,42.48 54.47,42.26 55.23,42.26 U7.28 ; U2.39 v3(33.74,75.41)
  High-Speed Digital Signals w0.254: v3(33.74,75.41) 33.74,75.23 33.24,74.73 33.24,74.25 33.58,73.91 35.65,73.91 57.35,52.2 57.35,43.02 56.9,42.57 54.09,42.57 v3(54,42.48)
CS2: length 40.9
  Top Layer w0.254: v3(64.26,66.12) 65.22,66.12 67.16,68.07 68.31,68.07 68.9,68.66 68.9,72.58 68.56,72.92 66.17,72.92 66.09,72.83 U3.39 ; v3(58.42,44.28) 58.37,44.33 U7.32
  High-Speed Digital Signals w0.254: v3(58.42,44.28) 64.26,50.12 v3(64.26,66.12)
CS3: length 50.1
  Top Layer w0.254: U7.51 53.75,53.71 53.47,53.42 53.47,48.09 v3(49.91,44.53) ; U15.39 39.33,16.44 v3(39.71,16.06)
  High-Speed Digital Signals w0.254: v3(39.71,16.06) 49.91,26.26 49.91,39.53 48.95,40.49 47.01,40.49 46.67,40.84 46.67,41.32 49.88,44.53 v3(49.91,44.53)
CS4: length 61.2
  Top Layer w0.254: U7.52 53.32,54.95 53.32,55.71 53.97,56.36 v3(53.97,56.85) ; v3(64.01,30.44) v3(64.01,42.12) ; v3(71.12,19.64) 71.03,19.55 71.03,19.52 70.47,18.96 70.47,18.46 70.82,18.1 71.03,18.1 71.84,17.29 71.96,17.29 73.15,16.1 73.15,14.56 72.54,13.95 71.11,13.95 U16.39
  High-Speed Digital Signals w0.254: v3(53.97,56.85) 61.51,49.31 61.51,48.2 57.84,44.52 57.84,44.04 58.18,43.7 62.43,43.7 v3(64.01,42.12) ; v3(64.01,30.44) 64.01,26.75 v3(71.12,19.64)
CS5: length 98.6
  Top Layer w0.254: v3(110.56,35.37) 110.56,35.91 110.25,36.22 U10.39 ; v3(42.8,33.74) 42.8,33.05 43.84,32.01 49.86,32.01 v3(55.63,26.25) ; v3(73.28,26.25) v3(60.71,26.25) ; v3(42.04,53.04) 41.17,53.04 40.92,52.79 40.24,52.79 U7.77
  High-Speed Digital Signals w0.254: v3(110.56,35.37) 109.56,34.37 107.64,34.37 105.35,32.08 79.11,32.08 v3(73.28,26.25) ; v3(42.8,33.74) 42.8,41.04 42.6,41.24 42.6,41.73 42.8,41.93 42.8,52.28 v3(42.04,53.04) ; v3(60.71,26.25) v3(55.63,26.25)
DRDY1: length 46.7
  Top Layer w0.254: U7.33 55.23,44.9 54.47,44.9 54.46,44.92 v3(53.59,44.92) ; v3(31.12,79.33) 32.27,79.33 U2.47
  Low-Speed Digital Signals w0.254: v3(53.59,44.92) 31.12,67.39 v3(31.12,79.33)
DRDY2: length 38
  Top Layer w0.254: U3.47 65.26,68.91 v3(66.41,68.91) ; v3(56.77,45.3) 56.74,45.33 U7.34
  Low-Speed Digital Signals w0.254: v3(56.77,45.3) 58.86,47.39 58.86,48.83 52.29,55.4 51.97,55.4 51.63,55.74 51.63,56.67 51.94,56.98 54.49,56.98 v3(66.41,68.91)
DRDY3: length 42.2
  Top Layer w0.254: v3(36.96,20.37) 38.12,20.37 ; v3(43.18,41.49) 52.75,51.06 U7.53
  Low-Speed Digital Signals w0.254: v3(36.96,20.37) 36.96,29.94 41.81,34.79 41.81,40.12 v3(43.18,41.49)
DRDY4: length 57.1
  Top Layer w0.254: U7.54 52.25,55.91 v3(52.53,56.2) ; v3(72.26,9.94) 71.1,9.94 U16.47
  Low-Speed Digital Signals w0.254: v3(52.53,56.2) 52.53,56.13 72.26,36.41 v3(72.26,9.94)
DRDY5: length 80.7
  Top Layer w0.254: v3(56.56,48.82) 59.72,48.82 61.17,47.37 v3(62.82,47.37) ; v3(114.25,39.45) 114.25,37.5 ; U7.81 40.27,50.76 41.03,50.76 41.41,50.38 v3(49.28,50.38)
  Low-Speed Digital Signals w0.254: v3(49.28,50.38) 55,50.38 v3(56.56,48.82) ; v3(114.25,39.45) 106.33,47.37 v3(62.82,47.37)
E1: length 31.4
  Top Layer w0.254: U4.1 91.81,82.24 R6.1 ; R115.1 11.57,7.03 8.51,7.03 ; U1.1 5.72,66 R40.1 ; R47.1 100.84,63.69 U5.1 ; R77.1 97.65,23.28 U17.1
E2: length 29.9
  Top Layer w0.254: U4.2 91.05,79.7 R13.1 ; R37.1 6.49,68.54 U1.2 ; U5.2 103.38,62.93 R49.1 ; U17.2 96.89,20.74 R84.1 ; R114.1 12.33,9.57 U14.2
E3: length 29.1
  Top Layer w0.254: U4.3 90.66,77.16 R17.1 ; R30.1 6.87,71.08 U1.3 ; R106.1 12.71,12.11 U14.3 ; R92.1 96.51,18.2 U17.3 ; R51.1 105.92,62.55 U5.3
E4: length 28
  Top Layer w0.254: R96.1 13.22,14.65 U14.4 ; R28.1 90.16,74.62 U4.4 ; R93.1 96,15.66 U17.4 ; R53.1 108.46,62.04 U5.4 ; R20.1 7.37,73.62 U1.4
E5: length 27.2
  Top Layer w0.254: U14.5 13.6,17.19 R85.1 ; U17.5 95.62,13.12 R103.1 ; R55.1 111,61.66 U5.5 ; U4.5 89.78,72.08 R33.1 ; U1.5 7.76,76.16 R19.1
E6: length 26.7
  Top Layer w0.254: U4.6 R39.1 ; U17.6 R111.1 ; U5.6 R57.1 ; U14.6 R87.1 ; U1.6 R9.1
E7: length 27.8
  Top Layer w0.254: U5.7 116.08,61.92 R59.1 ; U14.7 13.34,22.27 R82.1 ; R4.1 7.5,81.24 U1.7 ; R42.1 90.03,67 U4.7 ; U17.7 95.87,8.04 R116.1
E8: length 28.8
  Top Layer w0.254: U1.8 6.99,83.78 R2.1 ; R119.1 96.38,5.5 U17.8 ; R46.1 90.54,64.46 U4.8 ; U5.8 118.62,62.42 R61.1 ; U14.8 12.84,24.81 R73.1
IN1N: length 75.4
  Top Layer w0.252: 20.39,72.91 20.23,72.91 13.12,65.8 11.67,65.8 C35.2 ; 82.98,16.37 83.14,16.37 90.25,23.48 91.7,23.48 C117.2 ; C9.2 85.86,82.44 84.41,82.44 77.3,75.33 77.14,75.33 ; C49.2 100.64,57.75 100.64,56.3 107.75,49.19 107.75,49.02 ; C141.2 17.51,6.83 18.96,6.83 26.07,13.94 26.24,13.94
  Top Layer w0.254: 82.13,16.37 82.98,16.37 ; R48.2 100.4,59.71 C49.2 100.4,57.77 ; 77.14,75.33 76.28,75.33 ; R78.2 93.67,23.72 C117.2 91.73,23.72 ; R113.2 15.55,6.59 C141.2 17.49,6.59 ; R7.2 87.82,82.69 C9.2 85.89,82.69 ; 26.24,13.94 U15.15 ; R38.2 9.71,65.55 C35.2 11.64,65.55 ; 20.39,72.91 U2.15 ; U10.15 107.75,49.02
IN1P: length 76.7
  Top Layer w0.252: U2.16 12.99,64.15 C35.1 ; 76.28,75.83 84.54,84.08 86.1,84.08 ; C49.1 99,56.42 U10.16 ; 91.94,25.12 90.38,25.12 82.13,16.87 ; U15.16 18.84,5.19 C141.1
  Top Layer w0.254: C49.1 99,59.46 R47.2 ; C141.1 15.8,5.19 R115.2 ; C35.1 9.96,64.15 R40.2 ; R77.2 93.41,25.12 91.94,25.12 ; 86.1,84.08 87.57,84.08 R6.2
IN2N: length 69.8
  Top Layer w0.252: 76.28,74.33 77.3,74.33 82.61,79.64 C19.2 ; C50.2 103.45,54.49 108.75,49.19 U10.13 ; C133.2 20.77,9.64 26.07,14.94 U15.13 ; 82.13,15.37 83.14,15.37 88.45,20.67 C126.2 ; C32.2 14.93,68.6 20.23,73.91 U2.13
  Top Layer w0.254: R16.2 87.95,79.64 C19.2 ; C133.2 15.42,9.64 R105.2 ; C126.2 93.79,20.67 R91.2 ; C32.2 9.58,68.6 R34.2 ; C50.2 103.45,59.84 R50.2
IN2P: length 131
  Top Layer w0.252: C50.1 102.05,59.46 100.89,60.62 97.98,60.62 97.84,60.47 97.84,56.05 106.98,46.9 108,46.9 108.25,47.16 U10.14 ; C19.1 87.57,81.04 88.73,82.2 88.73,85.1 88.58,85.25 84.16,85.25 75.01,76.1 75.01,75.09 75.27,74.83 76.28,74.83 ; C133.1 15.8,8.24 14.64,7.08 14.64,4.18 14.79,4.03 19.22,4.03 28.36,13.17 28.36,14.19 28.11,14.44 U15.14 ; 82.13,15.87 81.11,15.87 80.86,16.12 80.86,17.14 90,26.28 94.43,26.28 94.57,26.14 94.57,23.23 93.41,22.07 C126.1 ; C32.1 9.96,67.2 8.8,66.04 8.8,63.14 8.95,62.99 13.37,62.99 22.52,72.14 22.52,73.15 22.26,73.41 U2.14
  Top Layer w0.254: 101.65,59.86 101.81,59.86 R49.2 ; 87.97,81.44 87.97,81.27 R13.2 ; 93.81,22.47 93.81,22.31 R84.2 ; 9.56,66.8 9.56,66.97 R37.2 ; 15.41,7.84 15.41,8 R114.2
IN3N: length 65.8
  Top Layer w0.252: 82.13,14.37 88.69,14.37 C128.2 ; 76.28,73.33 82.84,73.33 C20.2 ; C24.2 14.69,74.91 U2.11 ; U10.11 109.75,54.73 C51.2 ; C131.2 20.53,15.94 U15.11
  Top Layer w0.254: C20.2 87.82,76.59 R29.2 ; R94.2 93.67,17.62 C128.2 ; R95.2 15.55,12.69 C131.2 ; R21.2 9.71,71.65 C24.2 ; R52.2 106.49,59.71 C51.2
IN3P: length 67.9
  Top Layer w0.252: C131.1 21.43,15.44 U15.12 ; C20.1 81.94,73.83 76.28,73.83 ; C24.1 15.59,74.41 U2.12 ; 82.13,14.87 87.79,14.87 C128.1 ; U10.12 109.25,53.83 C51.1
  Top Layer w0.254: C131.1 15.67,11.29 R106.2 ; R92.2 93.54,19.03 C128.1 ; R51.2 105.09,59.59 C51.1 ; R30.2 9.83,70.25 C24.1 ; R17.2 87.7,77.99 C20.1
IN4N: length 61.8
  Top Layer w0.252: C130.2 18.61,16.94 U15.9 ; U10.9 110.75,56.65 C52.2 ; C23.2 84.77,72.33 76.28,72.33 ; C22.2 12.77,75.91 U2.9 ; C129.2 90.61,13.37 82.13,13.37
  Top Layer w0.254: C52.2 109.42,59.71 R54.2 ; C22.2 9.71,74.57 R18.2 ; C129.2 93.67,14.7 R104.2 ; C23.2 87.82,73.67 R27.2 ; R97.2 15.55,15.61 C130.2
IN4P: length 63.7
  Top Layer w0.252: C130.1 19.51,16.44 U15.10 ; 76.28,72.83 83.87,72.83 C23.1 ; U10.10 110.25,55.75 C52.1 ; C129.1 89.71,13.87 82.13,13.87 ; 11.43,73.17 13.67,75.41 U2.10
  Top Layer w0.254: R53.2 108.02,59.71 C52.1 ; C23.1 87.83,75.07 R28.2 ; 11.43,73.17 9.71,73.17 R20.2 ; R96.2 15.55,14.21 C130.1 ; C129.1 93.67,16.1 R93.2
